# Altium project sion_os.PrjPcb
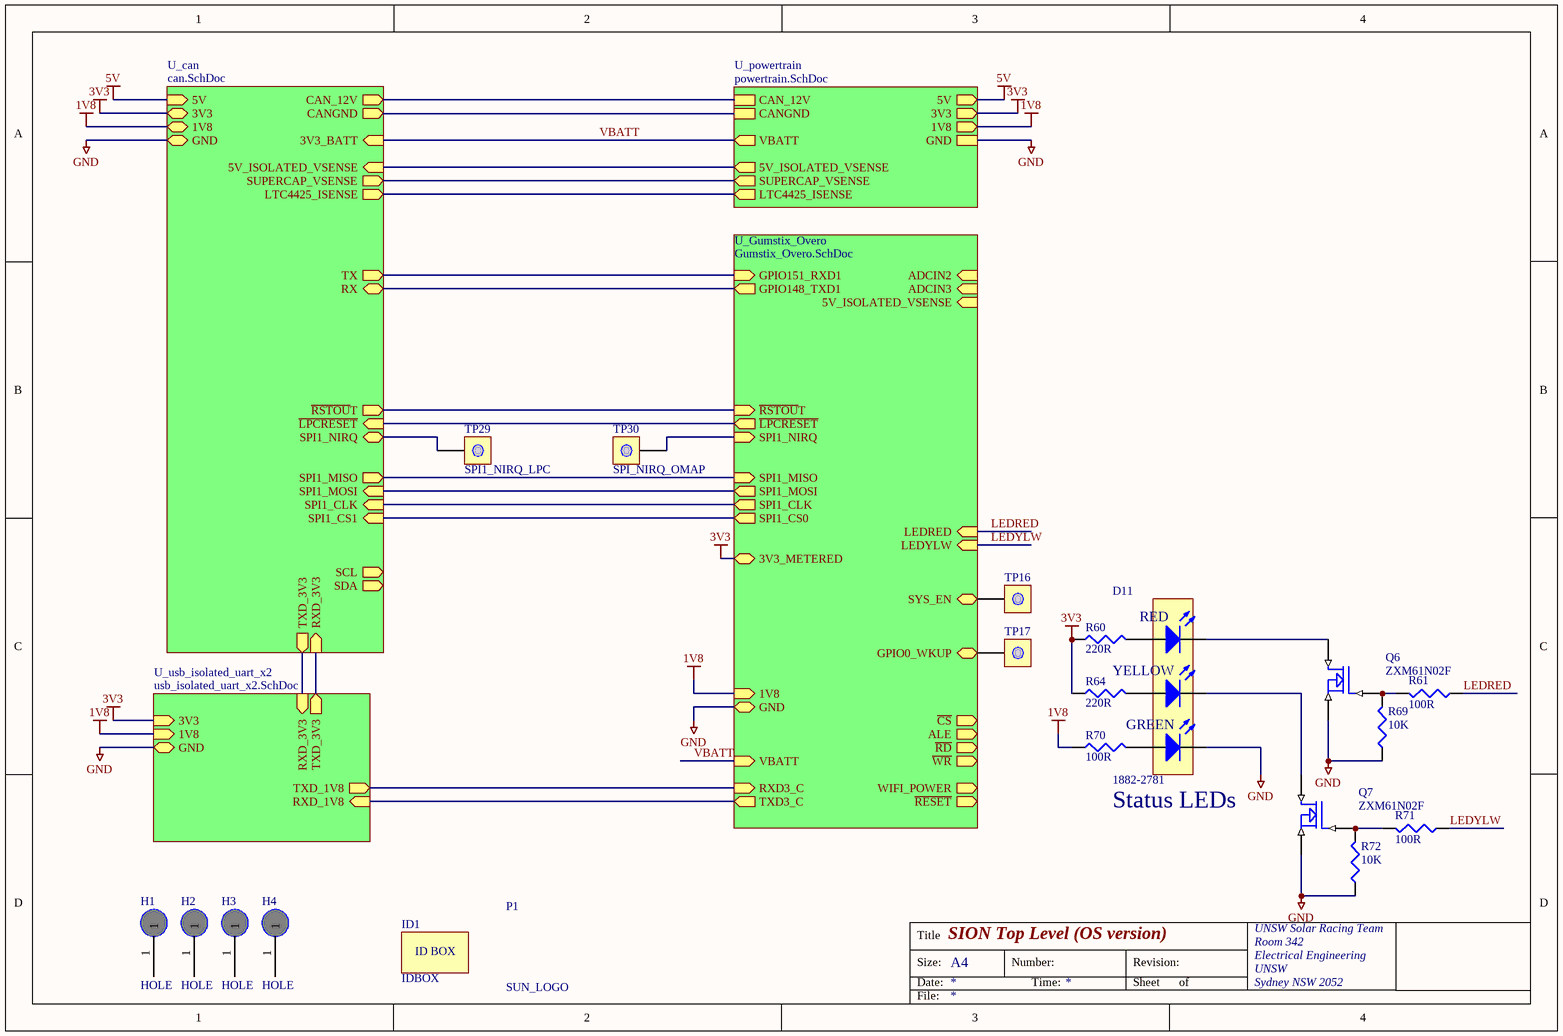
[diagram p0: toplevel_os.SchDoc]
9 sheets, 227 parts. Net scope: hierarchical (ports join the sheet entries above them; power ports are global).
Board files: endpanel_front.PcbDoc, endpanel_back.PcbDoc, sion.PcbDoc
Sheets:
  toplevel_os.SchDoc
    U_powertrain = powertrain.SchDoc
      U_supercap = supercap.SchDoc
      U_sepic = sepic.SchDoc
    U_can = can.SchDoc
      U_LPC1768 = LPC1768.SchDoc
      U_can_transciever_dualvolt_isolated = can_transciever_dualvolt_isolated.SchDoc
    U_usb_isolated_uart_x2 = usb_isolated_uart_x2.SchDoc
    U_Gumstix_Overo = Gumstix_Overo.SchDoc

## Sheet toplevel_os.SchDoc: SION Top Level (OS version)
size A4; Organization: UNSW Solar Racing Team; Address3: UNSW; Address4: Sydney NSW 2052; Address2: Electrical Engineering; Address1: Room 342

### Parts
D11  1882-2781  [LED_TRILEVEL]
H1  HOLE  [#6]
H2  HOLE  [#6]
H3  HOLE  [#6]
H4  HOLE  [#6]
ID1  IDBOX  [IDBOX]
P1  SUN_LOGO  [SUNSWIFTLOGO]
Q6  ZXM61N02F  [SOT23-3]
Q7  ZXM61N02F  [SOT23-3]
R60  220R  [0603]
R61  100R  [0603]
R64  220R  [0603]
R69  10K  [0603]
R70  100R  [0603]
R71  100R  [0603]
R72  10K  [0603]
TP16  SYS_EN  [TESTPOINT]  (value not drawn)
TP17  WKUP  [TESTPOINT]  (value not drawn)
TP29  SPI1_NIRQ_LPC  [TESTPOINT]
TP30  SPI_NIRQ_OMAP  [TESTPOINT]

### Sub-sheets
U_can = can.SchDoc: CAN_12V (out), CANGND (out), 3V3, 1V8, 5V (in), GND, SPI1_MISO (out), SPI1_MOSI (in), SPI1_CLK (in), SPI1_CS1 (in), SPI1_NIRQ, TXD_3V3 (out), RXD_3V3 (in), 3V3_BATT (in), ~{RSTOU}T (out), ~{LPCRESET} (in), SDA (out), SCL (out), TX (out), RX, 5V_ISOLATED_VSENSE (in), LTC4425_ISENSE (out), SUPERCAP_VSENSE (out)
U_Gumstix_Overo = Gumstix_Overo.SchDoc: SPI1_MISO (in), SPI1_MOSI (out), SPI1_CLK (out), SPI1_NIRQ (in), SPI1_CS0 (out), SYS_EN (bidir), RXD3_C (in), TXD3_C (out), ADCIN3 (in), ADCIN2 (in), GPIO148_TXD1 (out), GPIO151_RXD1 (in), GPIO0_WKUP (bidir), ~{CS} (out), ALE (out), ~{RD} (out), ~{WR} (out), 3V3_METERED, 1V8 (in), GND, ~{RSTOU}T (in), ~{LPCRESET} (out), ~{RESET} (out), 5V_ISOLATED_VSENSE (in), WIFI_POWER (out), LEDRED (in), LEDYLW (in), VBATT (in)
U_powertrain = powertrain.SchDoc: GND, 5V_ISOLATED_VSENSE (out), SUPERCAP_VSENSE (out), CAN_12V, CANGND, 3V3 (out), LTC4425_ISENSE (out), 5V (out), 1V8 (out), VBATT (out)
U_usb_isolated_uart_x2 = usb_isolated_uart_x2.SchDoc: TXD_3V3 (out), RXD_3V3 (in), 3V3 (in), 1V8 (in), TXD_1V8 (out), RXD_1V8 (in), GND

### Nets
1V8: R70.1 ; sheet U_powertrain/1V8, sheet U_can/1V8, sheet U_usb_isolated_uart_x2/1V8, sheet U_Gumstix_Overo/1V8
3V3: R60.1 R64.1 ; sheet U_powertrain/3V3, sheet U_can/3V3, sheet U_usb_isolated_uart_x2/3V3, sheet U_Gumstix_Overo/3V3_METERED  [project net VDDA]
5V: sheet U_powertrain/5V, sheet U_can/5V  [project net 5V_REDUNDANT]
CAN_12V: sheet U_powertrain/CAN_12V, sheet U_can/CAN_12V
CANGND: sheet U_powertrain/CANGND, sheet U_can/CANGND
GND: D11.1(K) Q6.2(S) Q7.2(S) R69.1 R72.1 ; sheet U_powertrain/GND, sheet U_can/GND, sheet U_usb_isolated_uart_x2/GND, sheet U_Gumstix_Overo/GND  [project net VREFN]
~{LPCRESET}: sheet U_can/~{LPCRESET}, sheet U_Gumstix_Overo/~{LPCRESET}
LEDRED: R61.1 ; sheet U_Gumstix_Overo/LEDRED
LEDYLW: R71.1 ; sheet U_Gumstix_Overo/LEDYLW
~{PFO}: sheet U_powertrain/5V_ISOLATED_VSENSE, sheet U_can/5V_ISOLATED_VSENSE
~{RSTOU}T: sheet U_can/~{RSTOU}T, sheet U_Gumstix_Overo/~{RSTOU}T
UART1_RXD: sheet U_can/TXD_3V3, sheet U_usb_isolated_uart_x2/RXD_3V3
VBATT: sheet U_powertrain/VBATT, sheet U_can/3V3_BATT, sheet U_Gumstix_Overo/VBATT
NetC35_1: sheet U_powertrain/LTC4425_ISENSE, sheet U_can/LTC4425_ISENSE
NetC36_1: sheet U_powertrain/SUPERCAP_VSENSE, sheet U_can/SUPERCAP_VSENSE
NetD11_2: D11.2(K) Q7.3(D)
NetD11_3: D11.3(K) Q6.3(D)
NetD11_4: D11.4(A) R60.2
NetD11_5: D11.5(A) R64.2
NetD11_6: D11.6(A) R70.2
NetQ6_1: Q6.1(G) R61.2 R69.2
NetQ7_1: Q7.1(G) R71.2 R72.2
NetTP16_0: TP16.0(TP) ; sheet U_Gumstix_Overo/SYS_EN
NetTP17_0: TP17.0(TP) ; sheet U_Gumstix_Overo/GPIO0_WKUP
NetTP19_0: sheet U_can/RXD_3V3, sheet U_usb_isolated_uart_x2/TXD_3V3
NetTP20_0: sheet U_usb_isolated_uart_x2/RXD_1V8, sheet U_Gumstix_Overo/TXD3_C
NetTP22_0: sheet U_usb_isolated_uart_x2/TXD_1V8, sheet U_Gumstix_Overo/RXD3_C
NetTP29_0: TP29.0(TP) ; sheet U_can/SPI1_NIRQ
NetTP30_0: TP30.0(TP) ; sheet U_Gumstix_Overo/SPI1_NIRQ
NetU6_J4_24: sheet U_can/RX, sheet U_Gumstix_Overo/GPIO148_TXD1
NetU6_J4_27: sheet U_can/SPI1_CS1, sheet U_Gumstix_Overo/SPI1_CS0
NetU6_J4_43: sheet U_can/SPI1_CLK, sheet U_Gumstix_Overo/SPI1_CLK
NetU6_J4_44: sheet U_can/SPI1_MOSI, sheet U_Gumstix_Overo/SPI1_MOSI
NetU6_J4_45: sheet U_can/SPI1_MISO, sheet U_Gumstix_Overo/SPI1_MISO
NetU6_J4_48: sheet U_can/TX, sheet U_Gumstix_Overo/GPIO151_RXD1

Not connected (* = marked no-connect by the designer): H1 1; H2 1; H3 1; H4 1

### Notes on the sheet
- Status LEDs
- Title
- Size:
- Date:
- A4
- Number:
- Time:
- Revision:
- Sheet
- of
- File:
- (in symbol IDBOX) ID BOX
- (in symbol LED-TRILEVEL) RED; YELLOW; GREEN

### Library data of the parts
D11 = LED-TRILEVEL: Three level LED; Farnell: 1461596; Digikey: 350-1751-ND; DigikeyPrice: 3.22; FarnellPrice: 4.56
Q6 Q7 = ZXM61N02F: 1.7A, 20V N-Channel Enhancement mode FET; Digikey: ZXM61N02FCT-ND; DigikeyPrice: 0.66; Farnell: 9525270; FarnellPrice: 1.35
R60 R61 R64 R69-R72 = RES1: Resistor; Order#: 9331697; Supplier: Farnell; Price: 0.05
TP16 TP17 TP29 TP30 = TEST: TEST POINT

## Sheet powertrain.SchDoc: SION Power Train
size A4; Organization: UNSW Solar Racing Team; Address3: UNSW; Address4: Sydney NSW 2052; Address2: Electrical Engineering; Address1: Rm 342
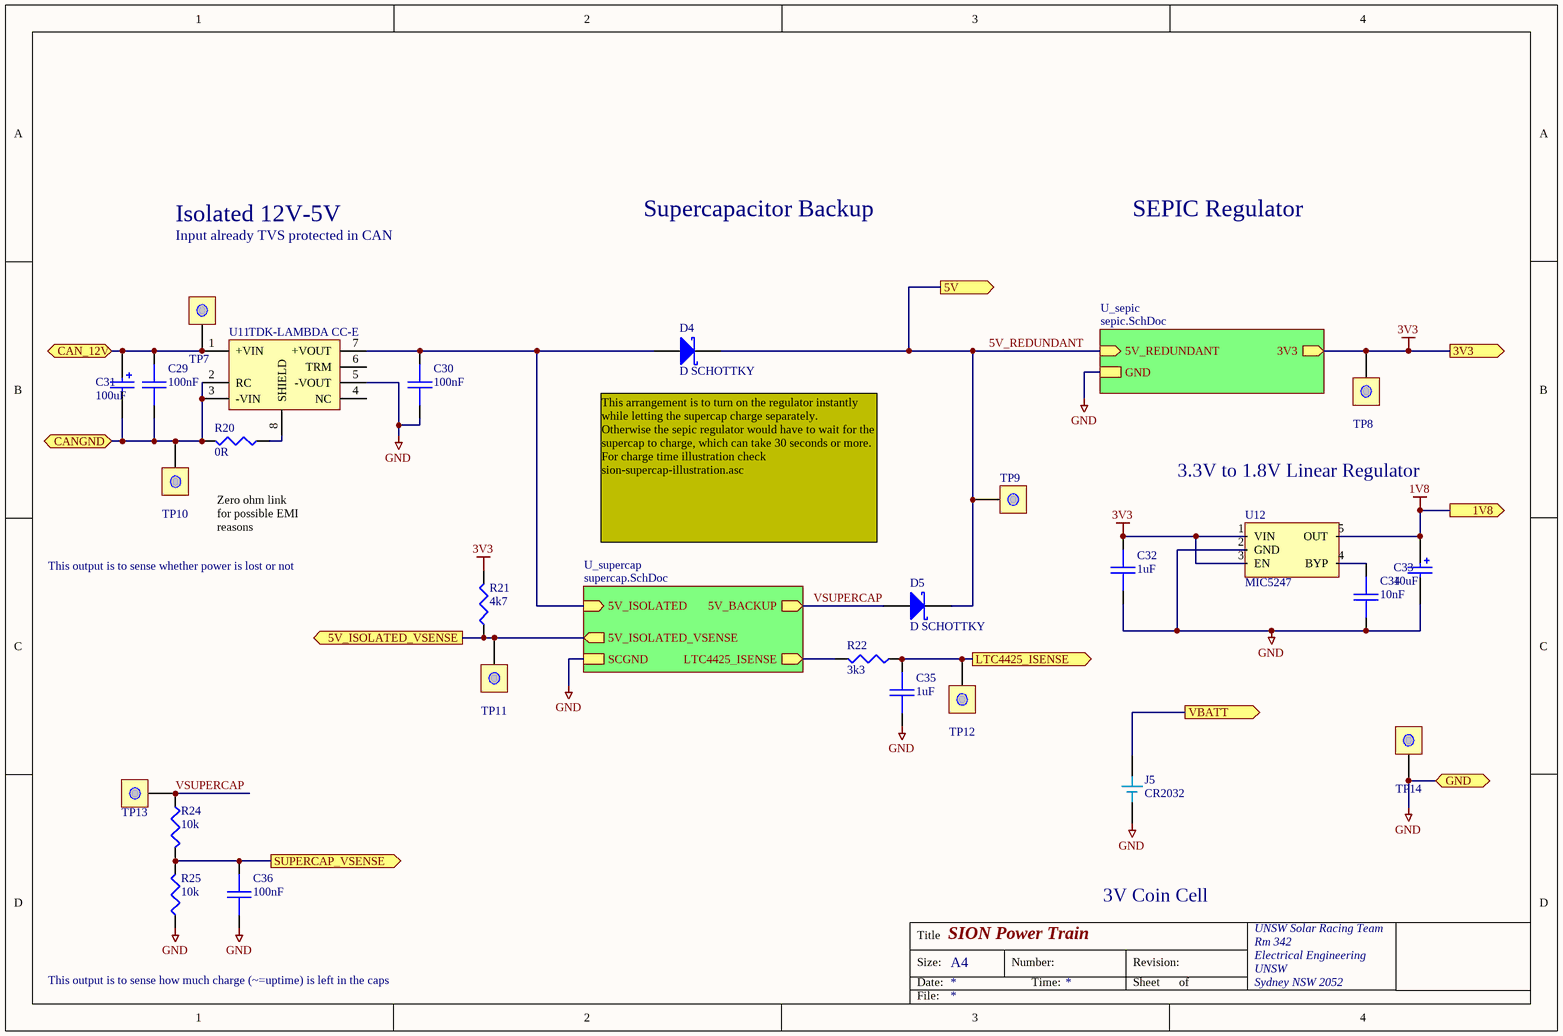
[diagram p1: powertrain.SchDoc]

### Parts
C29  100nF  [0603]
C30  100nF  [0603]
C31  100uF  [MCCT-CASED]
C32  1uF  [0805]
C33  10uF  [MCCT-CASEA]
C34  10nF  [0603]
C35  1uF  [0805]
C36  100nF  [0603]
D4  D SCHOTTKY  [DIODE-D1.5mm]
D5  D SCHOTTKY  [DIODE-D1.5mm]
J5  CR2032  [CR2032_VERTICAL]
R20  0R  [1206]
R21  4k7  [0603]
R22  3k3  [0603]
R24  10k  [0805]
R25  10k  [0805]
TP7  CAN12V  [TESTPOINT]  (value not drawn)
TP8  3V3  [TESTPOINT]  (value not drawn)
TP9  5V  [TESTPOINT]  (value not drawn)
TP10  CANGND  [TESTPOINT]  (value not drawn)
TP11  VSENSE  [TESTPOINT]  (value not drawn)
TP12  ISENSE  [TESTPOINT]  (value not drawn)
TP13  VCAP  [TESTPOINT]  (value not drawn)
TP14  GND  [TESTPOINT]  (value not drawn)
U11  TDK-LAMBDA CC-E  [CC10-F-E]
U12  MIC5247  [SOT23-5]

### Sub-sheets
U_sepic = sepic.SchDoc: 3V3 (out), 5V_REDUNDANT (in), GND
U_supercap = supercap.SchDoc: LTC4425_ISENSE (out), 5V_ISOLATED (in), 5V_BACKUP (out), SCGND, 5V_ISOLATED_VSENSE (out)

### Ports
1V8 (out), 3V3 (out), 5V (out), 5V_ISOLATED_VSENSE (out), CAN_12V, CANGND, GND, LTC4425_ISENSE (out), SUPERCAP_VSENSE (out), VBATT (out)

### Nets
1V8: C33.1 U12.5(OUT) ; port 1V8
3V3: C32.1 R21.2 TP8.0(TP) U12.1(VIN) U12.3(EN) ; port 3V3, sheet U_sepic/3V3  [project net VDDA]
5V_REDUNDANT: D4.K D5.K TP9.0(TP) ; port 5V, sheet U_sepic/5V_REDUNDANT
CAN_12V: C29.1 C31.1 TP7.0(TP) U11.1(+VIN) ; port CAN_12V
CANGND: C29.2 C31.2 R20.2 TP10.0(TP) U11.2(RC) U11.3(-VIN) ; port CANGND
GND: C30.2 C32.2 C33.2 C34.2 C35.2 C36.2 J5.2 R25.1 TP14.0(TP) U11.5(-VOUT) U12.2(GND) ; port GND, sheet U_supercap/SCGND, sheet U_sepic/GND  [project net VREFN]
5V_ISOLATED: C30.1 D4.A U11.7(+VOUT) ; sheet U_supercap/5V_ISOLATED
~{PFO}: R21.1 TP11.0(TP) ; port 5V_ISOLATED_VSENSE, sheet U_supercap/5V_ISOLATED_VSENSE
PROG: R22.2 ; sheet U_supercap/LTC4425_ISENSE
VBATT: J5.1(3V) ; port VBATT
VSUPERCAP: D5.A R24.1 TP13.0(TP) ; sheet U_supercap/5V_BACKUP
NetC34_1: C34.1 U12.4(BYP)
NetC35_1: C35.1 R22.1 TP12.0(TP) ; port LTC4425_ISENSE
NetC36_1: C36.1 R24.2 R25.2 ; port SUPERCAP_VSENSE
NetR20_1: R20.1 U11.8(SHIELD)

Not connected (* = marked no-connect by the designer): U11 4(NC) 6(TRM)

### Notes on the sheet
- Isolated 12V-5V
- Input already TVS protected in CAN
- Supercapacitor Backup
- SEPIC Regulator
- 3.3V to 1.8V Linear Regulator
- This output is to sense whether power is lost or not
- Zero ohm link
  for possible EMI reasons
- (near D4) This arrangement is to turn on the regulator instantly while letting the supercap charge separately.
  Otherwise the sepic regulator would have to wait for the supercap to charge, which can take 30 seconds or more.
  For charge time illustration check sion-supercap-illustration.asc
- 3V Coin Cell
- This output is to sense how much charge (~=uptime) is left in the caps
- Title
- Size:
- Date:
- A4
- Number:
- Time:
- Revision:
- Sheet
- of
- File:

### Library data of the parts
C29 C30 C32 C34-C36 = CAP: Capacitor
C31 C33 = CAP POL3: Polarized Capacitor (Surface Mount); Revision: July-2002: Re-released for DXP Platform.
  C31: Digikey: 495-2256-1-ND; DigikeyPrice: 1.24; Farnell: 1658601; FarnellPrice: 2.64
  C33: Digikey: 399-3687-1-ND; DigikeyPrice: 0.54; Farnell: 1650980; FarnellPrice: 0.786
D4 D5 = D SCHOTTKY: Schottky Diode; RS: 3954196; Revision: July-2002: Re-released for DXP Platform.; Digikey: 95SQ015-ND; DigikeyPrice: 3.36; Farnell: 506795; FarnellPrice: 8.61
J5 = CR2032: Battery Coin CR2032 3V; Farnell: 1216359; Farnellprice: 3.97
R20-R22 R24 R25 = RES1: Resistor
  R24 R25: Farnell: 1612522; FarnellPrice: 0.022; Digikey: P10.0KCCT-ND; DigikeyPrice: 0.07
TP7-TP14 = TEST: TEST POINT
U11 = CC10-F-E: Isolated DC-DC Converter; Digikey: 445-2435-ND; Farnell: 1547717; FarnellPrice: 56.78; DigikeyPrice: 26.66
U12 = MIC5247: 150mA Low-Voltage Linear Regulator; Digikey: 576-1288-1-ND; DigikeyPrice: 1.08

## Sheet supercap.SchDoc: SION Supercapacitor Charger
size A4; Organization: UNSW Solar Racing Team; Address3: UNSW; Address4: Sydney NSW 2052; Address2: Electrical Engineering; Address1: Room 342
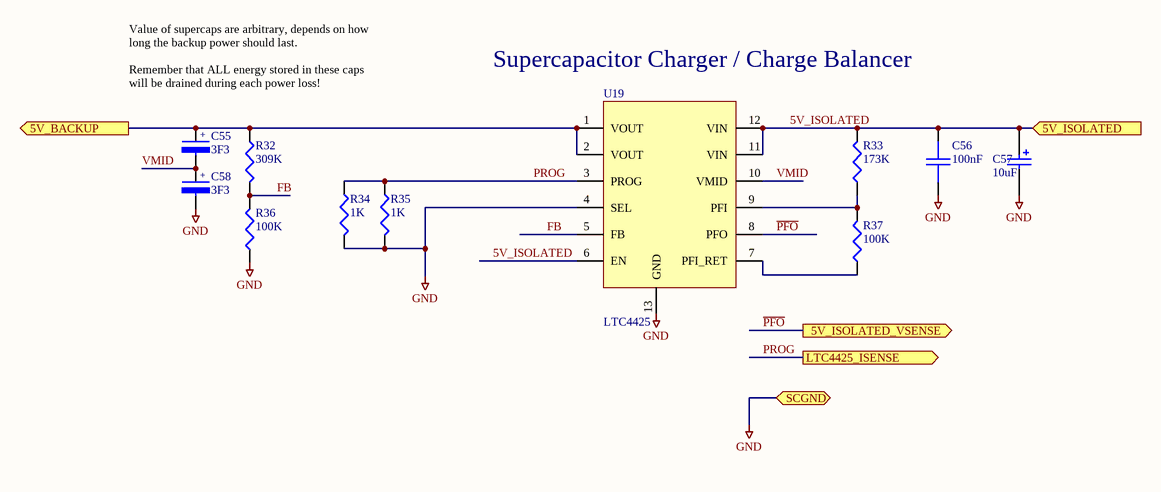
[diagram p2: supercap.SchDoc]

### Parts
C55  3F3  [ELECTROLYTIC-5-32]
C56  100nF  [0603]
C57  10uF  [MCCT-CASEA]
C58  3F3  [ELECTROLYTIC-5-32]
R32  309K  [0603]
R33  173K  [0805]
R34  1K  [0603]
R35  1K  [0603]
R36  100K  [0603]
R37  100K  [0603]
U19  LTC4425  [MS-12]

### Ports
5V_BACKUP (out), 5V_ISOLATED (in), 5V_ISOLATED_VSENSE (out), LTC4425_ISENSE (out), SCGND

### Nets
GND: C56.2 C57.2 C58.2 R34.2 R35.2 R36.1 U19.4(SEL) U19.13(GND) ; port SCGND  [project net VREFN]
5V_ISOLATED: C56.1 C57.1 R33.2 U19.6(EN) U19.11(VIN) U19.12(VIN) ; port 5V_ISOLATED
FB: R32.2 R36.2 U19.5(FB)
~{PFO}: U19.8(PFO) ; port 5V_ISOLATED_VSENSE
PROG: R34.1 R35.1 U19.3(PROG) ; port LTC4425_ISENSE
VMID: C55.2 C58.1 U19.10(VMID)
VSUPERCAP: C55.1 R32.1 U19.1(VOUT) U19.2(VOUT) ; port 5V_BACKUP
NetR33_1: R33.1 R37.2 U19.9(PFI)
NetR37_1: R37.1 U19.7(PFI_RET)

### Notes on the sheet
- Supercapacitor Charger / Charge Balancer
- Value of supercaps are arbitrary, depends on how long the backup power should last.
  Remember that ALL energy stored in these caps will be drained during each power loss!
- Title
- Size:
- Date:
- A4
- Number:
- Time:
- Revision:
- Sheet
- of
- File:
- (in symbol CAP-POL) +

### Library data of the parts
C55 C58 = CAP-POL: Supercap; Notes: Nichicon is preferred - higher voltage.; Digikey: 493-3293-ND; Farnell: 1853360; DigikeyPrice: 3.05; FarnellPrice: 4.15
C56 = CAP: Capacitor
C57 = CAP POL3: Polarized Capacitor (Surface Mount); Revision: July-2002: Re-released for DXP Platform.; Digikey: 399-3687-1-ND; DigikeyPrice: 0.54; Farnell: 1650980; FarnellPrice: 0.786
R32-R37 = RES1: Resistor
  R32: Farnell: 1797157; Digikey: P309KHCT-ND; DigikeyPrice: 0.04; FarnellPrice: 0.559
  R33: FArnell: 1151739; FarnellPrice: 0.157; Digikey: P75.0KHCT-ND; DigikeyPrice: 0.04
  R34 R35: Farnell: 9364366; Digikey: RR08P1.0KDCT-ND; DigikeyPrice: 0.148; FarnellPrice: 0.04
  R36 R37: Farnell: 1344361; FarnellPrice: 0.02; Digikey: CRT0603-BY-1003ELFCT-ND; DigikeyPrice: 0.25
U19 = LTC4425: Supercapacitor Charger; Farnell: 1839114; FarnellPrice: 12.63; Digikey: LTC4425EMSE#PBF-ND; DigikeyPrice: 5.0

## Sheet sepic.SchDoc: SION SEPIC v2 Prototype
size A4; Organization: UNSW Solar Racing Team; Address3: UNSW; Address4: Sydney NSW 2052; Address2: Electrical Engineering; Address1: Room 342
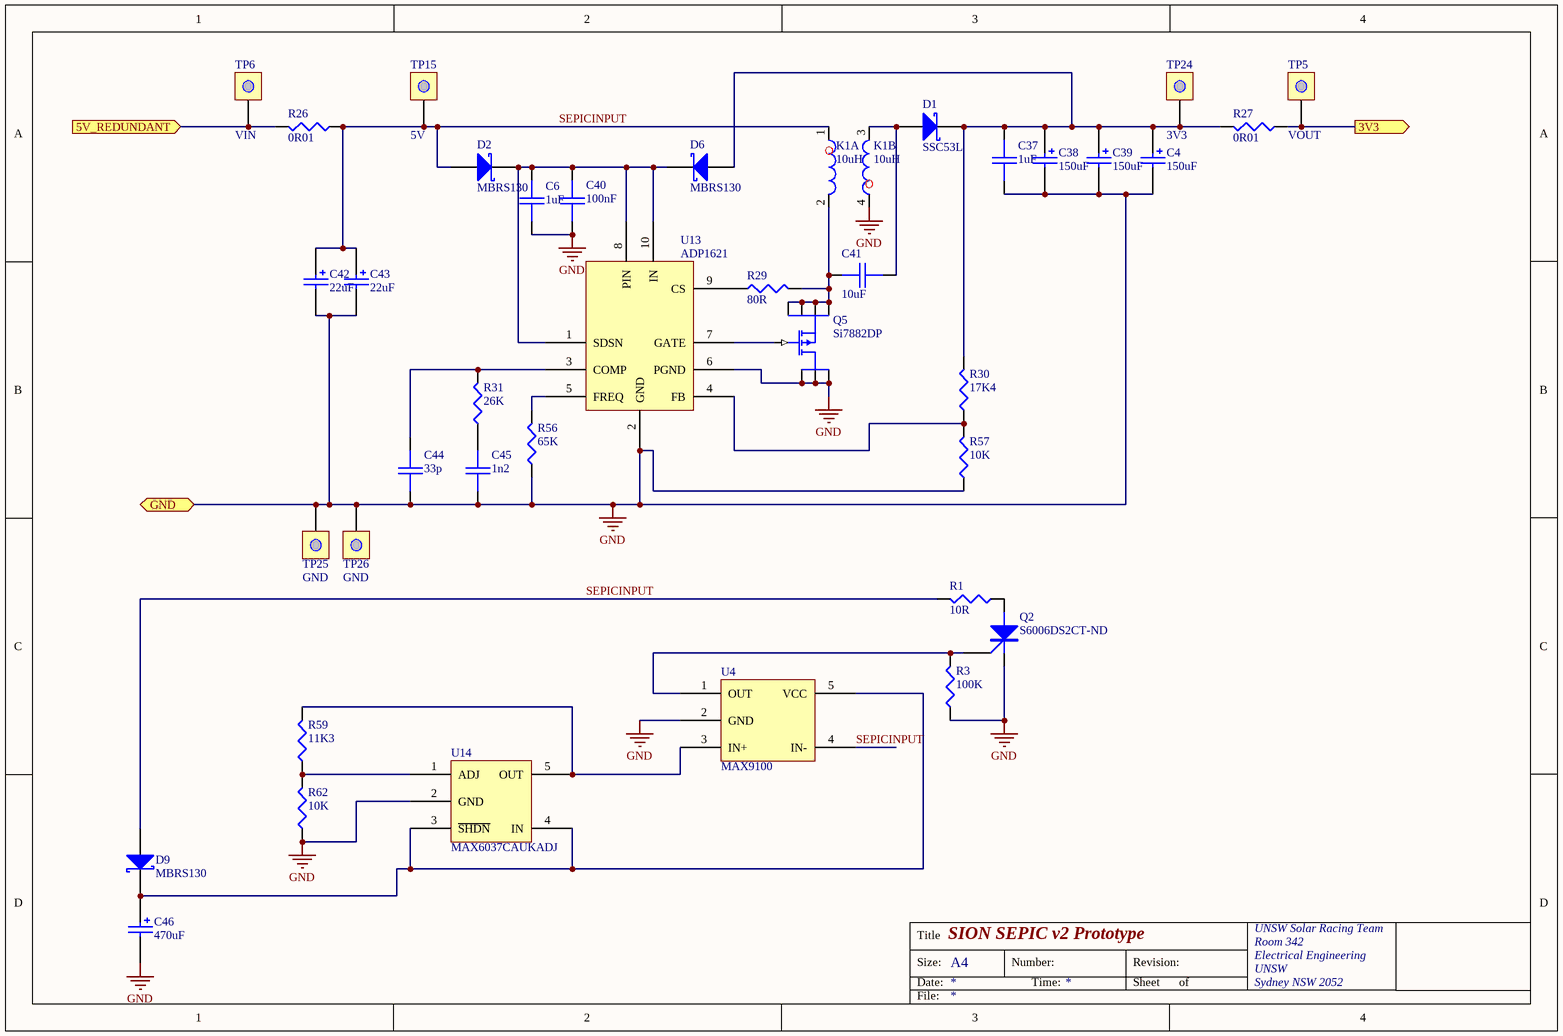
[diagram p3: sepic.SchDoc]

### Parts
C4  150uF  [MCCT-CASED]
C6  1uF  [0805]
C37  1uF  [0805]
C38  150uF  [MCCT-CASED]
C39  150uF  [MCCT-CASED]
C40  100nF  [0603]
C41  10uF  [0805]
C42  22uF  [MCCT-CASEB]
C43  22uF  [MCCT-CASEB]
C44  33p  [0603]
C45  1n2  [0603]
C46  470uF  [MCCT-CASED]
D1  SSC53L  [SMC]
D2  MBRS130  [SMB]
D6  MBRS130  [SMB]
D9  MBRS130  [SMB]
K1  10uH  [CTX2]  (parts A,B of 2)
Q2  S6006DS2CT-ND  [DPAK_N-MOSFET]
Q5  Si7882DP  [SO8]
R1  10R  [DIODE0.7]
R3  100K  [1206]
R26  0R01  [1206]
R27  0R01  [1206]
R29  80R  [0603]
R30  17K4  [1206]
R31  26K  [1206]
R56  65K  [0603]
R57  10K  [1206]
R59  11K3  [1206]
R62  10K  [1206]
TP5  VOUT  [TESTPOINT]
TP6  VIN  [TESTPOINT]
TP15  5V  [TESTPOINT]
TP24  3V3  [TESTPOINT]
TP25  GND  [TESTPOINT]
TP26  GND  [TESTPOINT]
U4  MAX9100  [SOT23-5]
U13  ADP1621  [MSOP10]
U14  MAX6037CAUKADJ  [SOT23-5]

### Ports
3V3 (out), 5V_REDUNDANT (in), GND

### Nets
5V_REDUNDANT: R26.2 TP6.0(TP) ; port 5V_REDUNDANT
GND: C4.2 C6.2 C37.2 C38.2 C39.2 C40.1 C42.2 C43.2 C44.2 C45.2 C46.2 K1.4 Q2.1(K) Q5.1(S) Q5.2(S) Q5.3(S) R3.1 R56.1 R57.1 R62.1 TP25.0(TP) TP26.0(TP) U4.2(GND) U13.2(GND) U13.6(PGND) U14.2(GND) ; port GND  [project net VREFN]
VDDA: R27.1 TP5.0(TP) ; port 3V3
SEPICINPUT: C42.1 C43.1 D2.A D9.A K1.1 R1.2 R26.1 TP15.0(TP) U4.4(IN-)
NetC4_1: C4.1 C37.1 C38.1 C39.1 D1.K D6.A R27.2 R30.2 TP24.0(TP)
NetC6_1: C6.1 C40.2 D2.K D6.K U13.1(SDSN) U13.8(PIN) U13.10(IN)
NetC41_1: C41.1 K1.2 Q5.5(D) Q5.6(D) Q5.7(D) Q5.8(D) R29.2
NetC41_2: C41.2 D1.A K1.3
NetC44_1: C44.1 R31.2 U13.3(COMP)
NetC45_1: C45.1 R31.1
NetC46_1: C46.1 D9.K U4.5(VCC) U14.3(~{SHDN}) U14.4(IN)
NetQ2_2: Q2.2(A) R1.1
NetQ2_3: Q2.3(G) R3.2 U4.1(OUT)
NetQ5_4: Q5.4(G) U13.7(GATE)
NetR29_1: R29.1 U13.9(CS)
NetR30_1: R30.1 R57.2 U13.4(FB)
NetR56_2: R56.2 U13.5(FREQ)
NetR59_1: R59.1 R62.2 U14.1(ADJ)
NetR59_2: R59.2 U4.3(IN+) U14.5(OUT)

### Notes on the sheet
- Title
- Size:
- Date:
- A4
- Number:
- Time:
- Revision:
- Sheet
- of
- File:

### Library data of the parts
C4 C38 C39 C42 C43 C46 = CAP POL3: Polarized Capacitor (Surface Mount); Manufacturer: Generic Components; Class I: Passive; Value: 100pF; Published: 8-Jun-2000; Revision: July-2002: Re-released for DXP Platform.; Publisher: Altium Limited; Class II: Capacitor
  C4 C38 C39: Farnell: 1754096; FarnellPrice: 2.97
  C42 C43: Farnell: 1457447; FarnellPrice: 1.06
  C46: Digikey: 718-1780-1-ND
C6 C37 C40 C44 C45 = CAP: Capacitor
  C6 C37: Farnell: 1683651; FarnellPrice: 0.05
  C44: Farnell: 1816801; FarnellPrice: 0.05
  C45: Farnell: 3019664; FarnellPrice: 0.167
C41 = CAP: grm21br61a106k; Farnell: 1828805; FarnellPrice: 0.448
D1 D2 D6 D9 = D SCHOTTKY: Schottky Diode; Manufacturer: Generic Components; Class I: Discrete; Class II: Diode - Schottky; Published: 8-Jun-2000; Revision: July-2002: Re-released for DXP Platform.; Publisher: Altium Limited
  D1: Farnell: 1336558; FarnellPrice: 2.64
  D2 D6 D9: Farnell: 9556931; FarnellPrice: 0.43
K1 = CTX10-2-R: Coupled Power Inductor; Farnell: 1194198; Price: 8.53
Q2 = SCR: Sensitive SCR; Digikey: S6006DS2CT-ND
Q5 = Si7882DP: Power N mosfet; Farnell: 1470159; FarnellPrice: 5.15
R1 R3 R26 R27 R29-R31 R56 R57 R59 R62 = RES1: Resistor
  R1: Farnell: 1357872; FarnellPrice: 0.119
  R3 R57: Farnell: 1469669; FarnellPrice: 0.02
  R26 R27: Farnell: 8067520; FarnellPrice: 0.616
  R29: Farnell: 1644187; FarnellPrice: 0.075
  R30: Farnell: 1152720; FarnellPrice: 0.02
  R31: Farnell: 1152861; FarnellPrice: 0.02
  R56: Farnell: 1633712; FarnellPrice: 0.01
  R59: Digikey: RNCF1206BKC11K3CT-ND
  R62: Digikey: CRT1206-BY-1002ELFCT-ND
TP5 TP6 TP15 TP24-TP26 = TEST: TEST POINT
U4 = MAX9100EUK: Micropower comparator; Digikey: MAX9100EUK+TCT-ND
U13 = ADP1621: SEPIC / Boost Controller; Digikey: ADP1621ARMZ-R7CT-ND; DigikeyPrice: 2.97; Farnell: 1461500; FarnellPrice: 5.27
U14 = MAX6037CAUKADJ: Adjustable voltage reference; Digikey: MAX6037CAUKADJ+TCT-ND; DigikeyPrice: 2.05

## Sheet can.SchDoc
size A4; Organization: UNSW Solar Racing Team; Address3: UNSW; Address4: Sydney NSW 2052; Address2: Electrical Engineering; Address1: Room 342
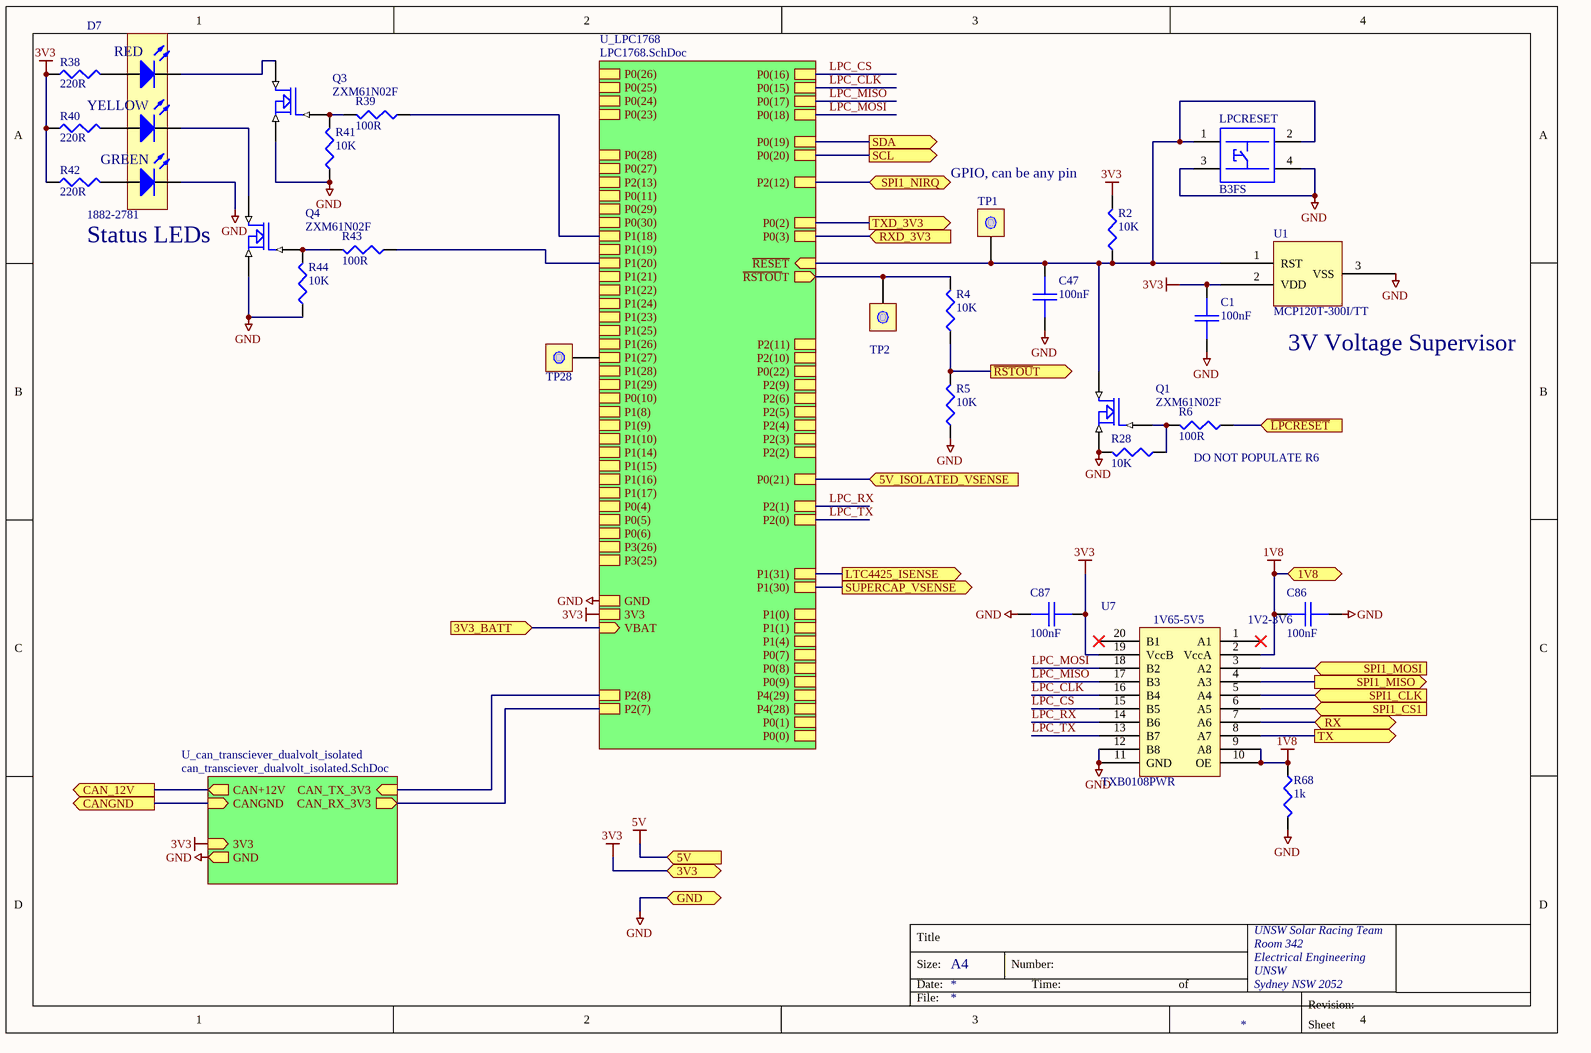
[diagram p4: can.SchDoc]

### Parts
C1  100nF  [0603]
C47  100nF  [0603]
C86  100nF  [0603]
C87  100nF  [0603]
D7  1882-2781  [LED_TRILEVEL]
LPCRESET  B3FS  [B3FS-1052]
Q1  ZXM61N02F  [SOT23-3]
Q3  ZXM61N02F  [SOT23-3]
Q4  ZXM61N02F  [SOT23-3]
R2  10K  [0603]
R4  10K  [0603]
R5  10K  [0603]
R6  100R  [0603]
R28  10K  [0603]
R38  220R  [0603]
R39  100R  [0603]
R40  220R  [0603]
R41  10K  [0603]
R42  220R  [0603]
R43  100R  [0603]
R44  10K  [0603]
R68  1k  [0603]
TP1  RESET  [TESTPOINT]  (value not drawn)
TP2  RSTOUT  [TESTPOINT]  (value not drawn)
TP28  CLKOUT  [TESTPOINT]  (value not drawn)
U1  MCP120T-300I/TT  [SOT23-3]
U7  TXB0108PWR  [TSSOP20]

### Sub-sheets
U_can_transciever_dualvolt_isolated = can_transciever_dualvolt_isolated.SchDoc: CAN+12V (out), CANGND, GND (out), 3V3, CAN_RX_3V3 (out), CAN_TX_3V3 (in)
U_LPC1768 = LPC1768.SchDoc: P0(26), P0(25), P0(24), P0(23), P1(31), P1(30), P0(28), P0(27), P3(26), P3(25), P0(29), P0(30), P1(18), P1(19), P1(20), P1(21), P1(22), P1(24), P1(23), P1(25), P1(26), P1(27), P1(28), P1(29), P0(0), P0(1), P0(10), P0(11), P2(13), P2(12), P2(11), P2(10), P0(22), P0(21), P0(20), P0(19), P0(18), P0(17), P0(15), P0(16), P2(9), P2(8), P2(7), P2(6), P2(5), P2(4), P2(3), P2(2), P2(1), P2(0), P0(2), P0(3), P1(0), P1(1), P1(4), P1(8), P1(9), P1(10), P1(14), P1(15), P1(16), P1(17), P0(4), P0(5), P0(6), P0(7), P0(8), P0(9), P4(29), P4(28), GND, 3V3, ~{RSTOU}T (out), ~{RESET} (in), VBAT (in)

### Ports
1V8, 3V3, 3V3_BATT (in), 5V (in), 5V_ISOLATED_VSENSE (in), CAN_12V (out), CANGND (out), GND, LTC4425_ISENSE (out), RX, RXD_3V3 (in), SCL (out), SDA (out), SPI1_CLK (in), SPI1_CS1 (in), SPI1_MISO (out), SPI1_MOSI (in), SPI1_NIRQ, SUPERCAP_VSENSE (out), TX (out), TXD_3V3 (out), ~{LPCRESET} (in), ~{RSTOU}T (out)

### Nets
1V8: C86.2 R68.2 U7.2(VccA) U7.9(A8) U7.10(OE) ; port 1V8
3V3: C1.1 C87.1 R2.2 R38.1 R40.1 R42.1 U1.2(VDD) U7.19(VccB) ; port 3V3, sheet U_LPC1768/3V3, sheet U_can_transciever_dualvolt_isolated/3V3  [project net VDDA]
CAN_12V: port CAN_12V, sheet U_can_transciever_dualvolt_isolated/CAN+12V
CANGND: port CANGND, sheet U_can_transciever_dualvolt_isolated/CANGND
GND: C1.2 C47.2 C86.1 C87.2 D7.1(K) LPCRESET.3(B2) LPCRESET.4(B1) Q1.2(S) Q3.2(S) Q4.2(S) R5.1 R28.2 R41.1 R44.1 R68.1 U1.3(VSS) U7.11(GND) U7.12(B8) ; port GND, sheet U_LPC1768/GND, sheet U_can_transciever_dualvolt_isolated/GND  [project net VREFN]
~{LPCRESET}: R6.2 ; port ~{LPCRESET}
LPC_CLK: U7.16(B4) ; sheet U_LPC1768/P0(15)
LPC_CS: U7.15(B5) ; sheet U_LPC1768/P0(16)
LPC_MISO: U7.17(B3) ; sheet U_LPC1768/P0(17)
LPC_MOSI: U7.18(B2) ; sheet U_LPC1768/P0(18)
LPC_RX: U7.14(B6) ; sheet U_LPC1768/P2(1)
LPC_TX: U7.13(B7) ; sheet U_LPC1768/P2(0)
~{PFO}: port 5V_ISOLATED_VSENSE, sheet U_LPC1768/P0(21)
~{RSTOU}T: R4.1 R5.2 ; port ~{RSTOU}T
SRST: C47.1 LPCRESET.1(A1) LPCRESET.2(A2) Q1.3(D) R2.1 TP1.0(TP) U1.1(RST) ; sheet U_LPC1768/~{RESET}
UART1_RXD: port TXD_3V3, sheet U_LPC1768/P0(2)
VBATT: port 3V3_BATT, sheet U_LPC1768/VBAT
NetC35_1: port LTC4425_ISENSE, sheet U_LPC1768/P1(31)
NetC36_1: port SUPERCAP_VSENSE, sheet U_LPC1768/P1(30)
NetD7_2: D7.2(K) Q4.3(D)
NetD7_3: D7.3(K) Q3.3(D)
NetD7_4: D7.4(A) R38.2
NetD7_5: D7.5(A) R40.2
NetD7_6: D7.6(A) R42.2
NetQ1_1: Q1.1(G) R6.1 R28.1
NetQ3_1: Q3.1(G) R39.2 R41.2
NetQ4_1: Q4.1(G) R43.2 R44.2
NetR4_2: R4.2 TP2.0(TP) ; sheet U_LPC1768/~{RSTOU}T
NetR39_1: R39.1 ; sheet U_LPC1768/P1(18)
NetR43_1: R43.1 ; sheet U_LPC1768/P1(20)
NetTP3_0: sheet U_LPC1768/P2(7), sheet U_can_transciever_dualvolt_isolated/CAN_RX_3V3
NetTP4_0: sheet U_LPC1768/P2(8), sheet U_can_transciever_dualvolt_isolated/CAN_TX_3V3
NetTP19_0: port RXD_3V3, sheet U_LPC1768/P0(3)
NetTP28_0: TP28.0(TP) ; sheet U_LPC1768/P1(27)
NetTP29_0: port SPI1_NIRQ, sheet U_LPC1768/P2(12)
NetU6_J4_24: U7.7(A6) ; port RX
NetU6_J4_27: U7.6(A5) ; port SPI1_CS1
NetU6_J4_43: U7.5(A4) ; port SPI1_CLK
NetU6_J4_44: U7.3(A2) ; port SPI1_MOSI
NetU6_J4_45: U7.4(A3) ; port SPI1_MISO
NetU6_J4_48: U7.8(A7) ; port TX
NetU10_58: port SCL, sheet U_LPC1768/P0(20)
NetU10_59: port SDA, sheet U_LPC1768/P0(19)

Not connected (* = marked no-connect by the designer): U7 1(A1)* 20(B1)*

### Notes on the sheet
- GPIO, can be any pin
- Status LEDs
- (near U1) 3V Voltage Supervisor
- DO NOT POPULATE R6
- Title
- Size:
- Date:
- A4
- Number:
- Time:
- of
- File:
- Revision:
- Sheet
- (in symbol LED-TRILEVEL) RED; YELLOW; GREEN
- (in symbol TXB0108PWR) 1V65-5V5; 1V2-3V6

### Library data of the parts
C1 C47 C86 C87 = CAP: Capacitor
D7 = LED-TRILEVEL: Three level LED; Farnell: 1461596; Digikey: 350-1751-ND; DigikeyPrice: 3.22; FarnellPrice: 4.56
LPCRESET = B3FS: SMD tactile switch; Farnell: 3121197; OMRON: B3FS-1052; Digikey: SW792-ND
Q1 Q3 Q4 = ZXM61N02F: 1.7A, 20V N-Channel Enhancement mode FET; Digikey: ZXM61N02FCT-ND; DigikeyPrice: 0.66; Farnell: 9525270; FarnellPrice: 1.35
R2 R4 R5 R28 R38-R44 = RES1: Resistor; Order#: 9331697; Supplier: Farnell; Price: 0.05
R6 R68 = RES1: Resistor
TP1 TP2 TP28 = TEST: TEST POINT
U1 = MCP120T: Voltage Supervisor; Farnell: 1292233; FarnellPrice: 0.951; Digikey: MCP120T-300I/TTCT-ND; DigikeyPrice: 0.54
U7 = TXB0108PWR: 4 bit bidirectional auto direction sense level translator; Digikey: 296-21527-1-ND

## Sheet LPC1768.SchDoc: LPC1768
size A4; Organization: UNSW Solar Racing Team; Address3: UNSW; Address4: Sydney NSW 2052; Address2: Electrical Engineering; Address1: Room 342
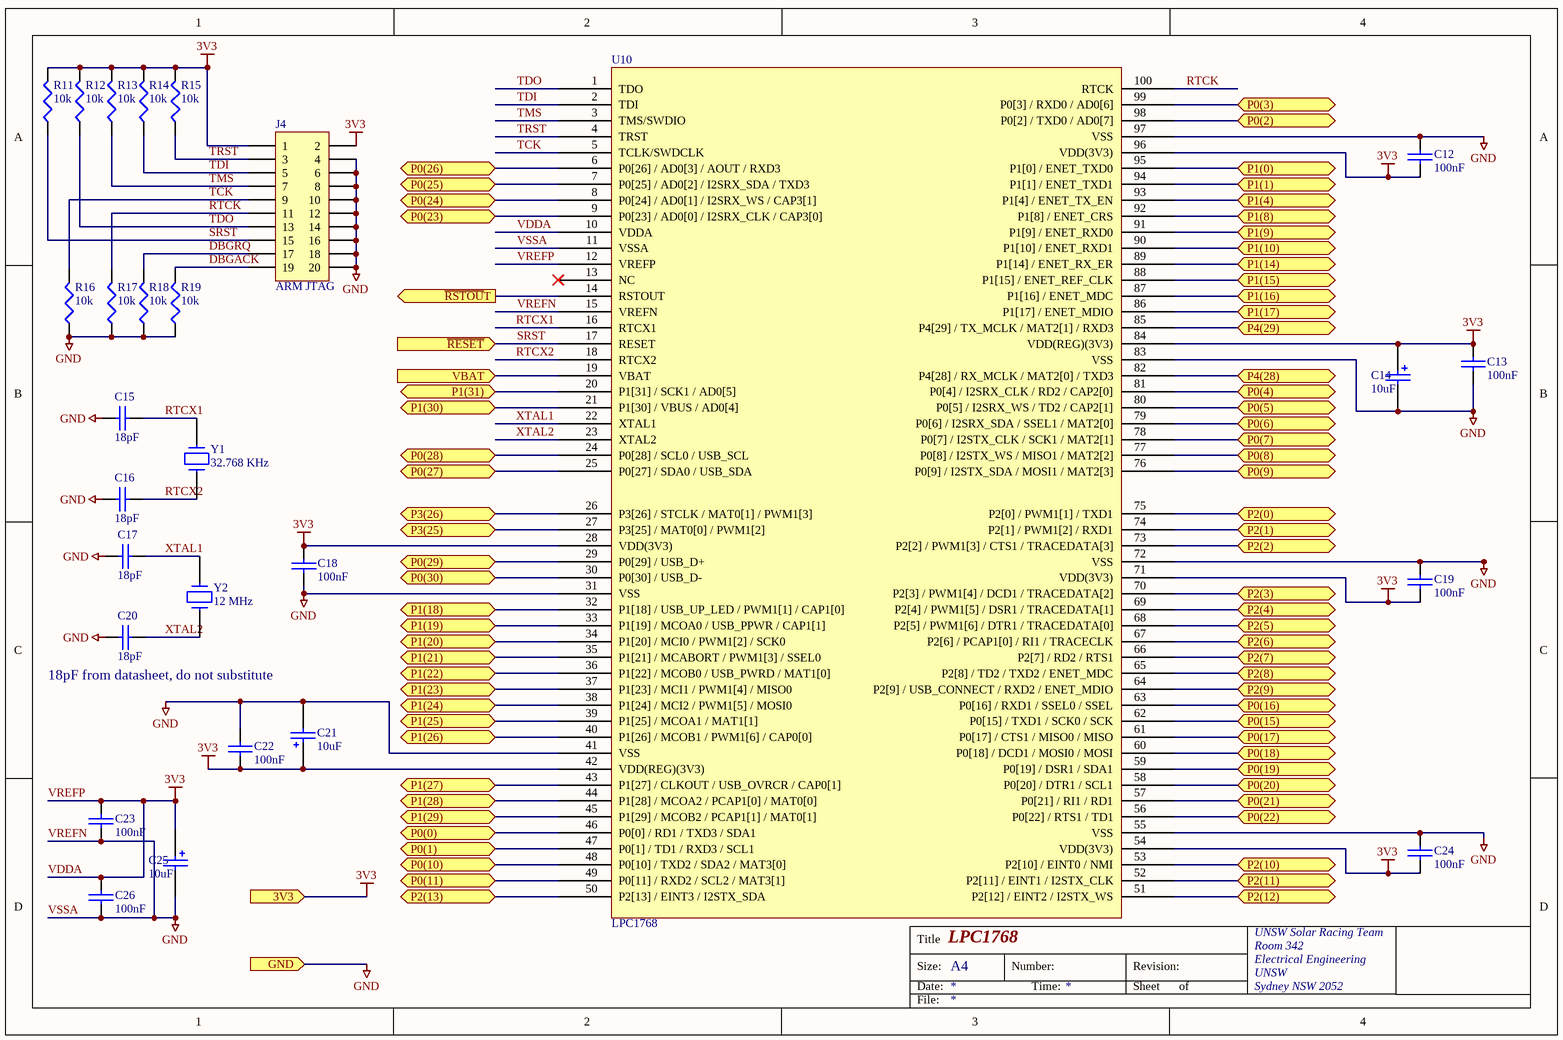
[diagram p5: LPC1768.SchDoc]

### Parts
C12  100nF  [0603]
C13  100nF  [0603]
C14  10uF  [MCCT-CASEA]
C15  18pF  [0603]
C16  18pF  [0603]
C17  18pF  [0603]
C18  100nF  [0603]
C19  100nF  [0603]
C20  18pF  [0603]
C21  10uF  [MCCT-CASEA]
C22  100nF  [0603]
C23  100nF  [0603]
C24  100nF  [0603]
C25  10uF  [MCCT-CASEA]
C26  100nF  [0603]
J4  ARM JTAG  [HDR2X10]
R11  10k  [0603]
R12  10k  [0603]
R13  10k  [0603]
R14  10k  [0603]
R15  10k  [0603]
R16  10k  [0603]
R17  10k  [0603]
R18  10k  [0603]
R19  10k  [0603]
U10  LPC1768  [QFP100]
Y1  32.768 KHz  [WATCHA]
Y2  12 MHz  [HC49/4H]

### Ports
3V3, GND, P0(0), P0(1), P0(2), P0(3), P0(4), P0(5), P0(6), P0(7), P0(8), P0(9), P0(10), P0(11), P0(15), P0(16), P0(17), P0(18), P0(19), P0(20), P0(21), P0(22), P0(23), P0(24), P0(25), P0(26), P0(27), P0(28), P0(29), P0(30), P1(0), P1(1), P1(4), P1(8), P1(9), P1(10), P1(14), P1(15), P1(16), P1(17), P1(18), P1(19), P1(20), P1(21), P1(22), P1(23), P1(24), P1(25), P1(26), P1(27), P1(28), P1(29), P1(30), P1(31), P2(0), P2(1), P2(2), P2(3), P2(4), P2(5), P2(6), P2(7), P2(8), P2(9), P2(10), P2(11), P2(12), P2(13), P3(25), P3(26), P4(28), P4(29), VBAT (in), ~{RESET} (in), ~{RSTOU}T (out)

### Nets
VDDA: C12.2 C13.1 C14.1 C18.1 C19.2 C21.1 C22.2 C23.1 C24.2 C25.1 C26.1 J4.1 J4.2 R11.2 R12.2 R13.2 R14.2 R15.2 U10.10(VDDA) U10.12(VREFP) U10.28(VDD(3V3)) U10.42(VDD(REG)(3V3)) U10.54(VDD(3V3)) U10.71(VDD(3V3)) U10.84(VDD(REG)(3V3)) U10.96(VDD(3V3)) ; port 3V3  [also labelled 3V3, VREFP]
VREFN: C12.1 C13.2 C14.2 C15.2 C16.2 C17.2 C18.2 C19.1 C20.2 C21.2 C22.1 C23.2 C24.1 C25.2 C26.2 J4.4 J4.6 J4.8 J4.10 J4.12 J4.14 J4.16 J4.18 J4.20 R16.1 R17.1 R18.1 R19.1 U10.11(VSSA) U10.15(VREFN) U10.31(VSS) U10.41(VSS) U10.55(VSS) U10.72(VSS) U10.83(VSS) U10.97(VSS) ; port GND  [also labelled GND, VSSA]
DBGACK: J4.19 R19.2
DBGRQ: J4.17 R18.2
LPC_CLK: U10.62(P0[15]_/_TXD1_/_SCK0_/_SCK) ; port P0(15)
LPC_CS: U10.63(P0[16]_/_RXD1_/_SSEL0_/_SSEL) ; port P0(16)
LPC_MISO: U10.61(P0[17]_/_CTS1_/_MISO0_/_MISO) ; port P0(17)
LPC_MOSI: U10.60(P0[18]_/_DCD1_/_MOSI0_/_MOSI) ; port P0(18)
LPC_RX: U10.74(P2[1]_/_PWM1[2]_/_RXD1) ; port P2(1)
LPC_TX: U10.75(P2[0]_/_PWM1[1]_/_TXD1) ; port P2(0)
~{PFO}: U10.57(P0[21]_/_RI1_/_RD1) ; port P0(21)
RTCK: J4.11 R17.2 U10.100(RTCK)
RTCX1: C15.1 U10.16(RTCX1) Y1.2
RTCX2: C16.1 U10.18(RTCX2) Y1.1
SRST: J4.15 R11.1 U10.17(RESET) ; port ~{RESET}
TCK: J4.9 R16.2 U10.5(TCLK/SWDCLK)
TDI: J4.5 R14.1 U10.2(TDI)
TDO: J4.13 R12.1 U10.1(TDO)
TMS: J4.7 R13.1 U10.3(TMS/SWDIO)
TRST: J4.3 R15.1 U10.4(TRST)
UART1_RXD: U10.98(P0[2]_/_TXD0_/_AD0[7]) ; port P0(2)
VBATT: U10.19(VBAT) ; port VBAT
XTAL1: C17.1 U10.22(XTAL1) Y2.1
XTAL2: C20.1 U10.23(XTAL2) Y2.2
NetC35_1: U10.20(P1[31]_/_SCK1_/_AD0[5]) ; port P1(31)
NetC36_1: U10.21(P1[30]_/_VBUS_/_AD0[4]) ; port P1(30)
NetR4_2: U10.14(RSTOUT) ; port ~{RSTOU}T
NetR39_1: U10.32(P1[18]_/_USB_UP_LED_/_PWM1[1]_/_CAP1[0]) ; port P1(18)
NetR43_1: U10.34(P1[20]_/_MCI0_/_PWM1[2]_/_SCK0) ; port P1(20)
NetTP3_0: U10.66(P2[7]_/_RD2_/_RTS1) ; port P2(7)
NetTP4_0: U10.65(P2[8]_/_TD2_/_TXD2_/_ENET_MDC) ; port P2(8)
NetTP19_0: U10.99(P0[3]_/_RXD0_/_AD0[6]) ; port P0(3)
NetTP28_0: U10.43(P1[27]_/_CLKOUT_/_USB_OVRCR_/_CAP0[1]) ; port P1(27)
NetTP29_0: U10.51(P2[12]_/_EINT2_/_I2STX_WS) ; port P2(12)
NetU10_6: U10.6(P0[26]_/_AD0[3]_/_AOUT_/_RXD3) ; port P0(26)
NetU10_7: U10.7(P0[25]_/_AD0[2]_/_I2SRX_SDA_/_TXD3) ; port P0(25)
NetU10_8: U10.8(P0[24]_/_AD0[1]_/_I2SRX_WS_/_CAP3[1]) ; port P0(24)
NetU10_9: U10.9(P0[23]_/_AD0[0]_/_I2SRX_CLK_/_CAP3[0]) ; port P0(23)
NetU10_24: U10.24(P0[28]_/_SCL0_/_USB_SCL) ; port P0(28)
NetU10_25: U10.25(P0[27]_/_SDA0_/_USB_SDA) ; port P0(27)
NetU10_26: U10.26(P3[26]_/_STCLK_/_MAT0[1]_/_PWM1[3]) ; port P3(26)
NetU10_27: U10.27(P3[25]_/_MAT0[0]_/_PWM1[2]) ; port P3(25)
NetU10_29: U10.29(P0[29]_/_USB_D+) ; port P0(29)
NetU10_30: U10.30(P0[30]_/_USB_D-) ; port P0(30)
NetU10_33: U10.33(P1[19]_/_MCOA0_/_USB_PPWR_/_CAP1[1]) ; port P1(19)
NetU10_35: U10.35(P1[21]_/_MCABORT_/_PWM1[3]_/_SSEL0) ; port P1(21)
NetU10_36: U10.36(P1[22]_/_MCOB0_/_USB_PWRD_/_MAT1[0]) ; port P1(22)
NetU10_37: U10.37(P1[23]_/_MCI1_/_PWM1[4]_/_MISO0) ; port P1(23)
NetU10_38: U10.38(P1[24]_/_MCI2_/_PWM1[5]_/_MOSI0) ; port P1(24)
NetU10_39: U10.39(P1[25]_/_MCOA1_/_MAT1[1]) ; port P1(25)
NetU10_40: U10.40(P1[26]_/_MCOB1_/_PWM1[6]_/_CAP0[0]) ; port P1(26)
NetU10_44: U10.44(P1[28]_/_MCOA2_/_PCAP1[0]_/_MAT0[0]) ; port P1(28)
NetU10_45: U10.45(P1[29]_/_MCOB2_/_PCAP1[1]_/_MAT0[1]) ; port P1(29)
NetU10_46: U10.46(P0[0]_/_RD1_/_TXD3_/_SDA1) ; port P0(0)
NetU10_47: U10.47(P0[1]_/_TD1_/_RXD3_/_SCL1) ; port P0(1)
NetU10_48: U10.48(P0[10]_/_TXD2_/_SDA2_/_MAT3[0]) ; port P0(10)
NetU10_49: U10.49(P0[11]_/_RXD2_/_SCL2_/_MAT3[1]) ; port P0(11)
NetU10_50: U10.50(P2[13]_/_EINT3_/_I2STX_SDA) ; port P2(13)
NetU10_52: U10.52(P2[11]_/_EINT1_/_I2STX_CLK) ; port P2(11)
NetU10_53: U10.53(P2[10]_/_EINT0_/_NMI) ; port P2(10)
NetU10_56: U10.56(P0[22]_/_RTS1_/_TD1) ; port P0(22)
NetU10_58: U10.58(P0[20]_/_DTR1_/_SCL1) ; port P0(20)
NetU10_59: U10.59(P0[19]_/_DSR1_/_SDA1) ; port P0(19)
NetU10_64: U10.64(P2[9]_/_USB_CONNECT_/_RXD2_/_ENET_MDIO) ; port P2(9)
NetU10_67: U10.67(P2[6]_/_PCAP1[0]_/_RI1_/_TRACECLK) ; port P2(6)
NetU10_68: U10.68(P2[5]_/_PWM1[6]_/_DTR1_/_TRACEDATA[0]) ; port P2(5)
NetU10_69: U10.69(P2[4]_/_PWM1[5]_/_DSR1_/_TRACEDATA[1]) ; port P2(4)
NetU10_70: U10.70(P2[3]_/_PWM1[4]_/_DCD1_/_TRACEDATA[2]) ; port P2(3)
NetU10_73: U10.73(P2[2]_/_PWM1[3]_/_CTS1_/_TRACEDATA[3]) ; port P2(2)
NetU10_76: U10.76(P0[9]_/_I2STX_SDA_/_MOSI1_/_MAT2[3]) ; port P0(9)
NetU10_77: U10.77(P0[8]_/_I2STX_WS_/_MISO1_/_MAT2[2]) ; port P0(8)
NetU10_78: U10.78(P0[7]_/_I2STX_CLK_/_SCK1_/_MAT2[1]) ; port P0(7)
NetU10_79: U10.79(P0[6]_/_I2SRX_SDA_/_SSEL1_/_MAT2[0]) ; port P0(6)
NetU10_80: U10.80(P0[5]_/_I2SRX_WS_/_TD2_/_CAP2[1]) ; port P0(5)
NetU10_81: U10.81(P0[4]_/_I2SRX_CLK_/_RD2_/_CAP2[0]) ; port P0(4)
NetU10_82: U10.82(P4[28]_/_RX_MCLK_/_MAT2[0]_/_TXD3) ; port P4(28)
NetU10_85: U10.85(P4[29]_/_TX_MCLK_/_MAT2[1]_/_RXD3) ; port P4(29)
NetU10_86: U10.86(P1[17]_/_ENET_MDIO) ; port P1(17)
NetU10_87: U10.87(P1[16]_/_ENET_MDC) ; port P1(16)
NetU10_88: U10.88(P1[15]_/_ENET_REF_CLK) ; port P1(15)
NetU10_89: U10.89(P1[14]_/_ENET_RX_ER) ; port P1(14)
NetU10_90: U10.90(P1[10]_/_ENET_RXD1) ; port P1(10)
NetU10_91: U10.91(P1[9]_/_ENET_RXD0) ; port P1(9)
NetU10_92: U10.92(P1[8]_/_ENET_CRS) ; port P1(8)
NetU10_93: U10.93(P1[4]_/_ENET_TX_EN) ; port P1(4)
NetU10_94: U10.94(P1[1]_/_ENET_TXD1) ; port P1(1)
NetU10_95: U10.95(P1[0]_/_ENET_TXD0) ; port P1(0)

Not connected (* = marked no-connect by the designer): U10 13(NC)*

### Notes on the sheet
- 18pF from datasheet, do not substitute
- Title
- Size:
- Date:
- A4
- Number:
- Time:
- Revision:
- Sheet
- of
- File:

### Library data of the parts
C12 C13 C18 C19 C22-C24 C26 = CAP: Capacitor; Farnell: 753-567; Price: 0.30
C14 C21 C25 = CAP POL3: Polarized Capacitor (Surface Mount); Revision: July-2002: Re-released for DXP Platform.; Digikey: 399-3687-1-ND; DigikeyPrice: 0.54; Farnell: 1650980; FarnellPrice: 0.786
C15-C17 C20 = CAP: Capacitor; Order#: 721-992; Price: 0.11; Supplier: Farnell
J4 = Header 10X2: Header, 10-Pin, Dual row; Farnell: 9733647; FarnellPrice: 3.38; Digikey: WM8146-ND; DigikeyPrice: 3.39
R11-R19 = RES1: Resistor
U10 = LPC1768: NXP Cortex-M3 Microcontroller, 100pin 100MHz; Farnell: 1718549; FarnellPrice: 18.94; Digikey: 568-4796-ND; DigikeyPrice: 11.44
Y1 Y2 = CRYSTAL
  Y1: Farnell: 1611828; FarnellPrice: 0.401; Digikey: 535-9032-ND; DigikeyPrice: 0.25
  Y2: Farnell: 7940142; FarnellPrice: 0.854; DigikeyPrice: 0.46; Digikey: 887-1013-ND

## Sheet can_transciever_dualvolt_isolated.SchDoc: Dual Isolated CAN transciever
size A4; Organization: UNSW Solar Racing Team; Address3: UNSW; Address4: Sydney NSW 2052; Address2: Electrical Engineering; Address1: Rm 109
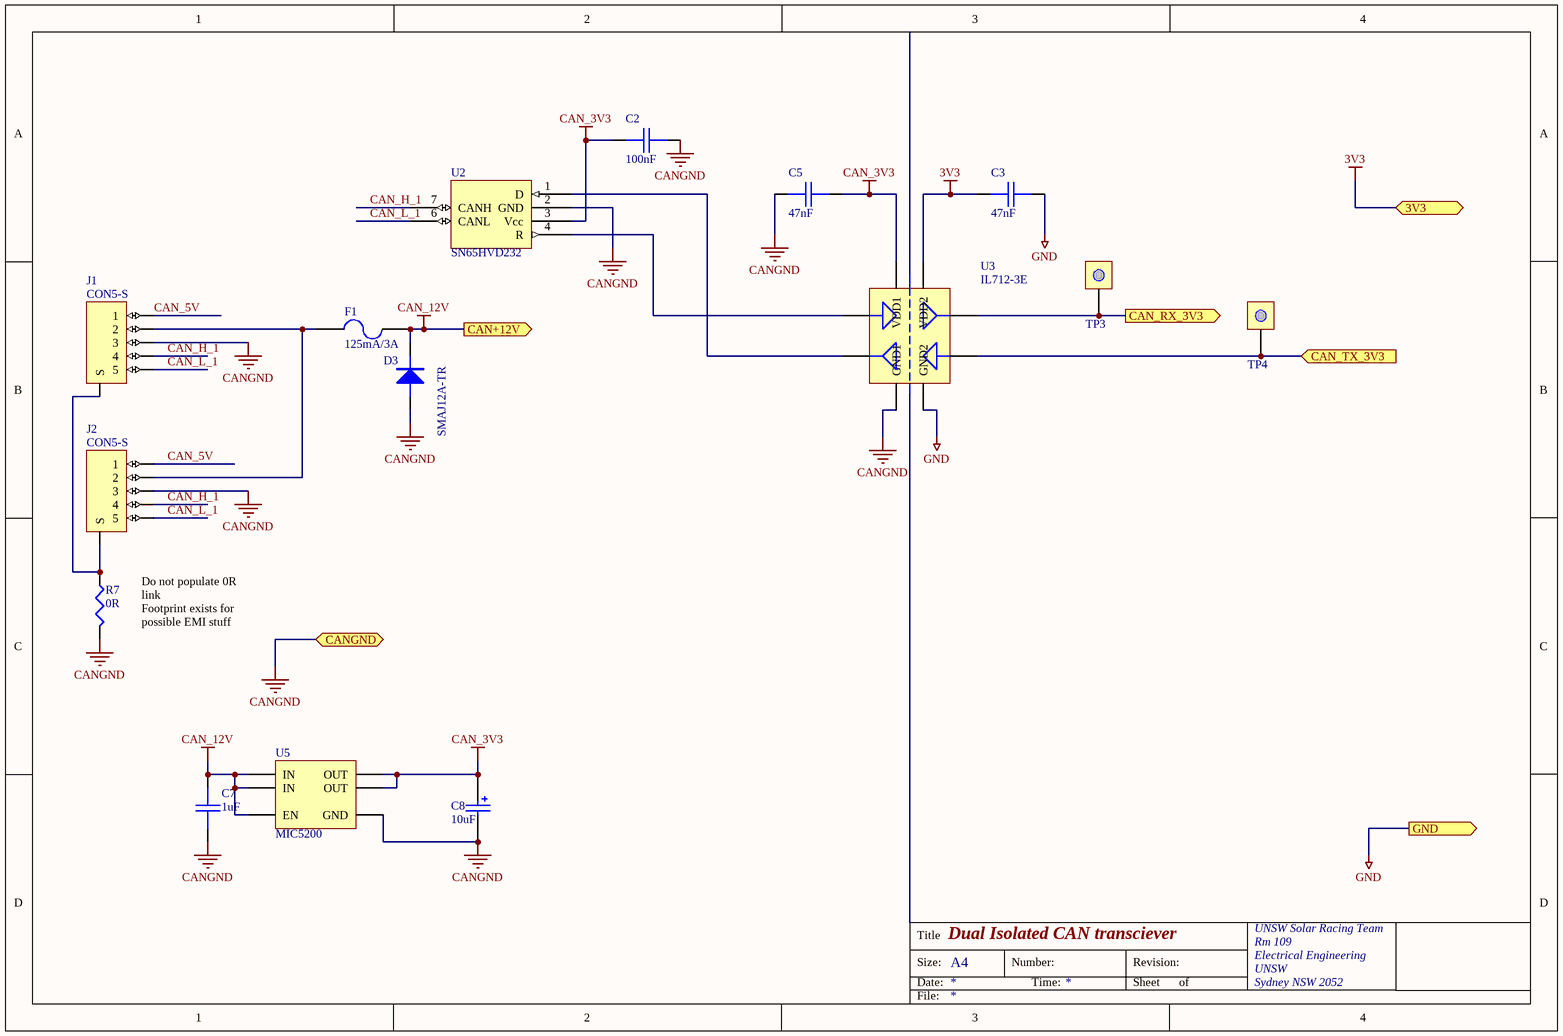
[diagram p6: can_transciever_dualvolt_isolated.SchDoc]

### Parts
C2  100nF  [0603]
C3  47nF  [0603]
C5  47nF  [0603]
C7  1uF  [0805]
C8  10uF  [MCCT-CASEA]
D3  SMAJ12A-TR  [SMA]
F1  125mA/3A  [LITTELFUSE-154]
J1  CON5-S  [TRIAD5F]
J2  CON5-S  [TRIAD5F]
R7  0R  [1206]
TP3  RX  [TESTPOINT]  (value not drawn)
TP4  TX  [TESTPOINT]  (value not drawn)
U2  SN65HVD232  [SO8]
U3  IL712-3E  [SO8]
U5  MIC5200  [SO8]

### Ports
3V3, CAN+12V (out), CAN_RX_3V3 (out), CAN_TX_3V3 (in), CANGND, GND (out)

### Nets
3V3: C3.1 U3.8(VDD2) ; port 3V3  [project net VDDA]
CAN_3V3: C2.1 C5.2 C8.1 U2.3(Vcc) U3.1(VDD1) U5.1(OUT) U5.2(OUT)
CAN_12V: C7.1 D3.K F1.2 U5.5(EN) U5.7(IN) U5.8(IN) ; port CAN+12V
CANGND: C2.2 C5.1 C7.2 C8.2 D3.A J1.3 J2.3 R7.2 U2.2(GND) U3.4(GND1) U5.4(GND) ; port CANGND
GND: C3.2 U3.5(GND2) ; port GND  [project net VREFN]
CAN_5V: J1.1 J2.1
CAN_H_1: J1.4 J2.4 U2.7(CANH)
CAN_L_1: J1.5 J2.5 U2.6(CANL)
NetF1_1: F1.1 J1.2 J2.2
NetJ1_0: J1.0(S) J2.0(S) R7.1
NetTP3_0: TP3.0(TP) U3.7(OUT1) ; port CAN_RX_3V3
NetTP4_0: TP4.0(TP) U3.6(IN2) ; port CAN_TX_3V3
NetU2_1: U2.1(D) U3.3(OUT2)
NetU2_4: U2.4(R) U3.2(IN1)

### Notes on the sheet
- Do not populate 0R link
  Footprint exists for possible EMI stuff
- Title
- Size:
- Date:
- A4
- Number:
- Time:
- Revision:
- Sheet
- of
- File:

### Library data of the parts
C2 C3 C5 C7 = CAP: Capacitor
  C3 C5: Farnell: 8820015; Digikey: 490-3287-1-ND; DigikeyPrice: 0.053; FarnellPrice: 0.085
C8 = CAP POL3: Polarized Capacitor (Surface Mount); Revision: July-2002: Re-released for DXP Platform.; Digikey: 399-3687-1-ND; DigikeyPrice: 0.54; Farnell: 1650980; FarnellPrice: 0.786
D3 = DIODE: 12V TVS Diode; Farnell: 9802754; FarnellPrice: 0.502; Digikey: 497-6503-1-ND; DigikeyPrice: 0.61
F1 = FUSE2: Fuse; Farnell: 9943749; FarnellPrice: 5.82; Digikey: F1307CT-ND; DigikeyPrice: 3.49
J1 J2 = CON5-S: Connector, 2 pin, with shield @ S; RS: 259-0993; RSPrice: 26.2; Farnell: 131-040; FarnellPrice: 32.75
R7 = RES1: Resistor
TP3 TP4 = TEST: TEST POINT
U2 = SN65HVD232: 3.3V CAN Transciever; Farnell: 1103107; FarnellPrice: 5.1; Digikey: 296-12282-5-ND; DigikeyPrice: 3.36
U3 = IL712: IL712 Optical Isolator; Digikey: 390-1061-5-ND; DigikeyPrice: 5.86; Farnell: 9570608; FarnellPrice: 9.4
U5 = MIC5200: MIC5200 - SO8; Part Field 2: 2.00; Part Field 3: Computer Science and Engineering; Part Field 4: David Johnson; Farnell: 1213488; FarnellPrice: 3.62; Digikey: 576-1246-ND; DigikeyPrice: 2.1

## Sheet usb_isolated_uart_x2.SchDoc
size A4; Organization: UNSW Solar Racing Team; Address3: UNSW; Address4: Sydney NSW 2052; Address2: Electrical Engineering; Address1: Room 342
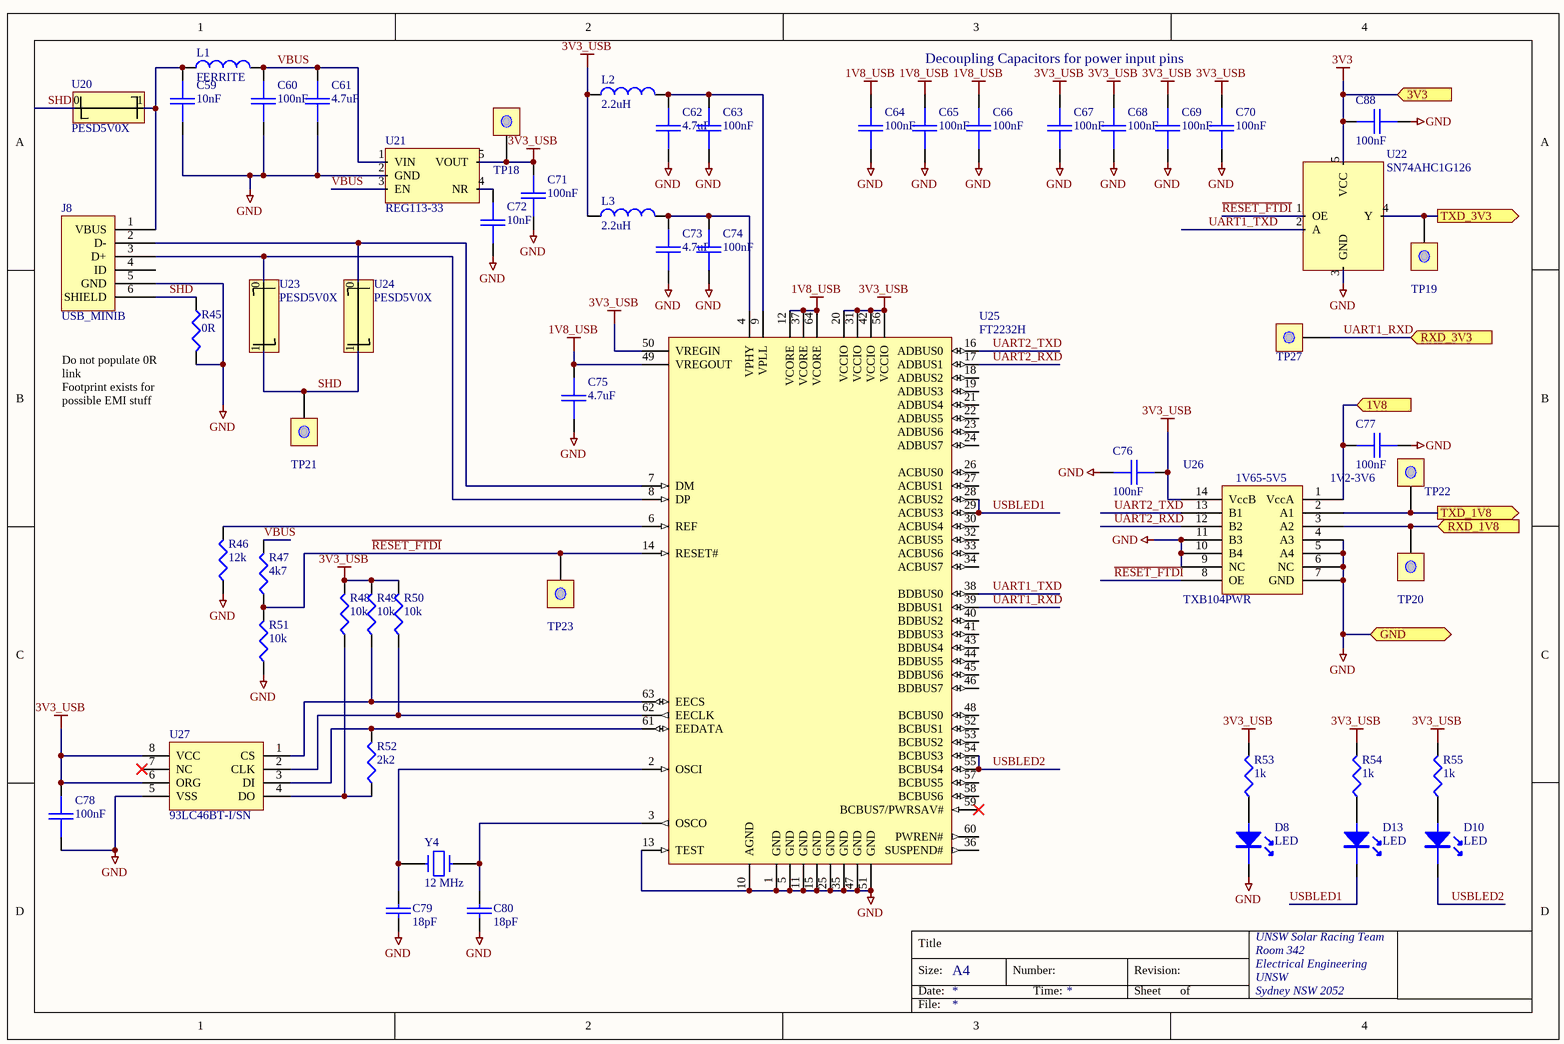
[diagram p7: usb_isolated_uart_x2.SchDoc]

### Parts
C59  10nF  [0603]
C60  100nF  [0603]
C61  4.7uF  [0603]
C62  4.7uF  [0603]
C63  100nF  [0603]
C64  100nF  [0603]
C65  100nF  [0603]
C66  100nF  [0603]
C67  100nF  [0603]
C68  100nF  [0603]
C69  100nF  [0603]
C70  100nF  [0603]
C71  100nF  [0603]
C72  10nF  [0603]
C73  4.7uF  [0603]
C74  100nF  [0603]
C75  4.7uF  [0603]
C76  100nF  [0603]
C77  100nF  [0603]
C78  100nF  [0603]
C79  18pF  [0603]
C80  18pF  [0603]
C88  100nF  [0603]
D8  LED  [0805LED]
D10  LED  [0805LED]
D13  LED  [0805LED]
J8  USB_MINIB  [USB_MINIB]
L1  FERRITE  [0603]
L2  2.2uH  [1210]
L3  2.2uH  [1210]
R45  0R  [1206]
R46  12k  [0603]
R47  4k7  [0603]
R48  10k  [0603]
R49  10k  [0603]
R50  10k  [0603]
R51  10k  [0603]
R52  2k2  [0603]
R53  1k  [0603]
R54  1k  [0603]
R55  1k  [0603]
TP18  3V3USB  [TESTPOINT]  (value not drawn)
TP19  TXD3V3  [TESTPOINT]  (value not drawn)
TP20  RXD1V8  [TESTPOINT]  (value not drawn)
TP21  SHD  [TESTPOINT]  (value not drawn)
TP22  TXD1V8  [TESTPOINT]  (value not drawn)
TP23  FTDI_RST  [TESTPOINT]  (value not drawn)
TP27  RXD3V3  [TESTPOINT]  (value not drawn)
U20  PESD5V0X  [SOD323]
U21  REG113-33  [SOT23-5]
U22  SN74AHC1G126  [SOT23-5]
U23  PESD5V0X  [SOD323]
U24  PESD5V0X  [SOD323]
U25  FT2232H  [QFP64]
U26  TXB104PWR  [TSSOP14-L]
U27  93LC46BT-I/SN  [SO8]
Y4  12 MHz  [HC49/4H]

### Ports
1V8 (in), 3V3 (in), GND, RXD_1V8 (in), RXD_3V3 (in), TXD_1V8 (out), TXD_3V3 (out)

### Nets
1V8: C77.1 U26.1(VccA) ; port 1V8
1V8_USB: C64.1 C65.1 C66.1 C75.1 U25.12(VCORE) U25.37(VCORE) U25.49(VREGOUT) U25.64(VCORE)
3V3: C88.2 U22.5(VCC) ; port 3V3  [project net VDDA]
3V3_USB: C67.1 C68.1 C69.1 C70.1 C71.1 C76.2 C78.1 L2.1 L3.1 R48.2 R49.2 R50.2 R53.2 R54.2 R55.2 TP18.0(TP) U21.5(VOUT) U25.20(VCCIO) U25.31(VCCIO) U25.42(VCCIO) U25.50(VREGIN) U25.56(VCCIO) U26.14(VccB) U27.6(ORG) U27.8(VCC)
GND: C59.1 C60.2 C61.2 C62.2 C63.2 C64.2 C65.2 C66.2 C67.2 C68.2 C69.2 C70.2 C71.2 C72.2 C73.2 C74.2 C75.2 C76.1 C77.2 C78.2 C79.2 C80.2 C88.1 D8.K J8.5(GND) R45.2 R46.1 R51.1 U21.2(GND) U22.3(GND) U25.1(GND) U25.5(GND) U25.10(AGND) U25.11(GND) U25.13(TEST) U25.15(GND) U25.25(GND) U25.35(GND) U25.47(GND) U25.51(GND) U26.4(A3) U26.5(A4) U26.6(NC) U26.7(GND) U26.9(NC) U26.10(B4) U26.11(B3) U27.5(VSS) ; port GND  [project net VREFN]
~{RESET_FTDI}: R47.1 R51.2 TP23.0(TP) U22.1(OE) U25.14(RESET#) U26.8(OE)
SHD: J8.6(SHIELD) R45.1 TP21.0(TP) U20.0 U23.1 U24.1
UART1_RXD: TP27.0(TP) U25.39(BDBUS1) ; port RXD_3V3
UART1_TXD: U22.2(A) U25.38(BDBUS0)
UART2_RXD: U25.17(ADBUS1) U26.12(B2)
UART2_TXD: U25.16(ADBUS0) U26.13(B1)
USBLED1: D13.K U25.28(ACBUS2) U25.29(ACBUS3)
USBLED2: D10.K U25.54(BCBUS3) U25.55(BCBUS4)
VBUS: C60.1 C61.1 L1.2 R47.2 U21.1(VIN) U21.3(EN)
NetC59_2: C59.2 J8.1(VBUS) L1.1 U20.1
NetC62_1: C62.1 C63.1 L2.2 U25.9(VPLL)
NetC72_1: C72.1 U21.4(NR)
NetC73_1: C73.1 C74.1 L3.2 U25.4(VPHY)
NetC79_1: C79.1 U25.2(OSCI) Y4.2
NetC80_1: C80.1 U25.3(OSCO) Y4.1
NetD8_A: D8.A R53.1
NetD10_A: D10.A R55.1
NetD13_A: D13.A R54.1
NetJ8_2: J8.2(D-) U24.0 U25.7(DM)
NetJ8_3: J8.3(D+) U23.0 U25.8(DP)
NetR46_2: R46.2 U25.6(REF)
NetR48_1: R48.1 R52.1 U27.4(DO)
NetR49_1: R49.1 U25.63(EECS) U27.1(CS)
NetR50_1: R50.1 U25.62(EECLK) U27.2(CLK)
NetR52_2: R52.2 U25.61(EEDATA) U27.3(DI)
NetTP19_0: TP19.0(TP) U22.4(Y) ; port TXD_3V3
NetTP20_0: TP20.0(TP) U26.3(A2) ; port RXD_1V8
NetTP22_0: TP22.0(TP) U26.2(A1) ; port TXD_1V8

Not connected (* = marked no-connect by the designer): J8 4(ID); U25 18(ADBUS2) 19(ADBUS3) 21(ADBUS4) 22(ADBUS5) 23(ADBUS6) 24(ADBUS7) 26(ACBUS0) 27(ACBUS1) 30(ACBUS4) 32(ACBUS5) 33(ACBUS6) 34(ACBUS7) 36(SUSPEND#) 40(BDBUS2) 41(BDBUS3) 43(BDBUS4) 44(BDBUS5) 45(BDBUS6) 46(BDBUS7) 48(BCBUS0) 52(BCBUS1) 53(BCBUS2) 57(BCBUS5) 58(BCBUS6) 59(BCBUS7/PWRSAV#)* 60(PWREN#); U27 7(NC)*

### Notes on the sheet
- Decoupling Capacitors for power input pins
- (near R45) Do not populate 0R link
  Footprint exists for possible EMI stuff
- Title
- Size:
- Date:
- A4
- Number:
- Time:
- Revision:
- Sheet
- of
- File:
- (in symbol TXB0104PWR) 1V65-5V5; 1V2-3V6

### Library data of the parts
C59-C78 C88 = CAP: Capacitor
  C61 C62 C73 C75: Digikey: 587-1441-1-ND; Farnell: 1688134; DigikeyPrice: 0.42; FarnellPrice: 0.585
C79 C80 = CAP: Capacitor; Order#: 721-992; Price: 0.11; Supplier: Farnell
J8 = USB_miniB_SMT: USB Mini B Connector; Farnell: 9786473; Digikey: H2961CT-ND; DigikeyPrice: 1.18; FarnellPrice: 3.08
L1-L3 = INDUCTOR: Revision: July-2002: Re-released for DXP Platform.
  L1: Digikey: 732-2389-1-ND; DigikeyPrice: 0.42; Farnell: 1748581; FarnellPrice: 0.567
  L2 L3: Farnell: 1198477; FarnellPrice: 0.353; Digikey: PCD1488CT-ND; DigikeyPrice: 0.22
R45-R55 = RES1: Resistor
  R46: Farnell: 1795293; FarnellPrice: 0.087; Digikey: P12.0KHCT-ND; DigikeyPrice: 0.04
  R47-R51 R53-R55: Farnell: Stock
  R52: Digikey: P2.20KHCT-ND; DigikeyPrice: 0.04
TP18-TP23 TP27 = TEST: TEST POINT
U20 U23 U24 = PESD5V0X: Ultra low capacitance bidirectional ESD protection diodes; Digikey: 568-4673-1-ND; Farnell: 8737606; FarnellPrice: 1.06
U21 = REG113-33: 400mA Low-Dropout Regulator; Digikey: REG113NA-3.3/3KCT-ND; DigikeyPrice: 3.15; Farnell: 1652375; FarnellPrice: 5.6
U22 = SN74AHC1G126: Single Bus Buffer Gate with 3 State Output; Digikey: 296-8746-1-ND; DigikeyPrice: 0.53; FArnell: 1287410; FarnellPrice: 0.85
U25 = FT2232H: Dual USB to UART/FIFO; Digikey: 768-1024-1-ND; Farnell: 1697461; DigikeyPrice: 6.71; FarnellPrice: 17.73
U26 = TXB0104PWR: 4 bit bidirectional auto direction sense level translator; Digikey: 296-21929-1-ND; Farnell: 1607891; FarnellPrice: 3.1; DigikeyPrice: 1.93
U27 = 93LC46BT-I/SN: Serial EEPROM; Digikey: 93LC46BT-I/SNCT-ND; Farnell: 1296585; FarnellPrice: 0.546; DigikeyPrice: 0.34
Y4 = CRYSTAL: Order#: 7940142; Price: 0.662; Supplier: Farnell
D8 D10 D13 = LED
  D8: Farnell: *; Digikey: 475-1151-1-ND; DigikeyPrice: 0.28
  D10: Digikey: 475-2676-1-ND; DigikeyPrice: 0.21
  D13: Farnell: *; Digikey: 475-2690-1-ND; DigikeyPrice: 0.21

## Sheet Gumstix_Overo.SchDoc
size A4
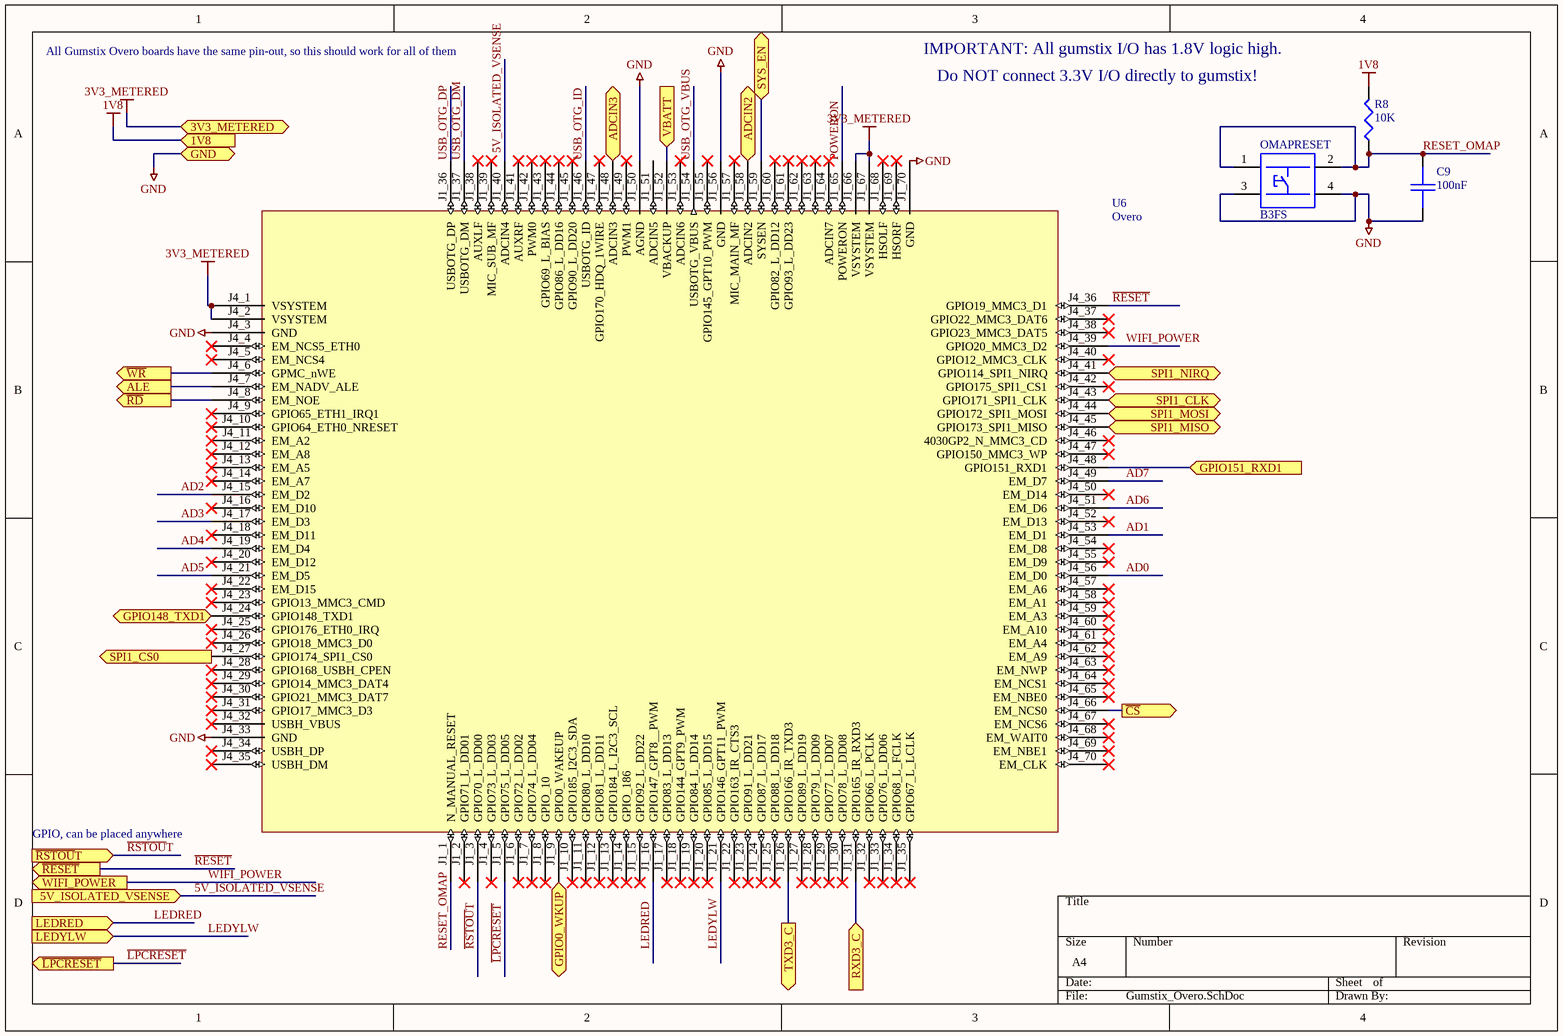
[diagram p8: Gumstix_Overo.SchDoc]

### Parts
C9  100nF  [0603]
OMAPRESET  B3FS  [B3FS-1052]
R8  10K  [0603]
U6  Overo  [Overo-bare]

### Ports
1V8 (in), 3V3_METERED, 5V_ISOLATED_VSENSE (in), ADCIN2 (in), ADCIN3 (in), ALE (out), GND, GPIO0_WKUP (bidir), GPIO148_TXD1 (out), GPIO151_RXD1 (in), LEDRED (in), LEDYLW (in), RXD3_C (in), SPI1_CLK (out), SPI1_CS0 (out), SPI1_MISO (in), SPI1_MOSI (out), SPI1_NIRQ (in), SYS_EN (bidir), TXD3_C (out), VBATT (in), WIFI_POWER (out), ~{CS} (out), ~{LPCRESET} (out), ~{RD} (out), ~{RESET} (out), ~{RSTOU}T (in), ~{WR} (out)

### Nets
1V8: R8.2 ; port 1V8
3V3_METERED: U6.J1_66(VSYSTEM) U6.J1_67(VSYSTEM) U6.J4_1(VSYSTEM) U6.J4_2(VSYSTEM) ; port 3V3_METERED  [project net VDDA]
GND: C9.2 OMAPRESET.3(B2) OMAPRESET.4(B1) U6.J1_50(AGND) U6.J1_56(GND) U6.J1_70(GND) U6.J4_3(GND) U6.J4_33(GND) ; port GND  [project net VREFN]
5V_ISOLATED_VSENSE: U6.J1_40(ADCIN4) ; port 5V_ISOLATED_VSENSE
AD0: U6.J4_56(EM_D0)
AD1: U6.J4_53(EM_D1)
AD2: U6.J4_15(EM_D2)
AD3: U6.J4_17(EM_D3)
AD4: U6.J4_19(EM_D4)
AD5: U6.J4_21(EM_D5)
AD6: U6.J4_51(EM_D6)
AD7: U6.J4_49(EM_D7)
~{LPCRESET}: U6.J1_5(GPIO75_L_DD05) ; port ~{LPCRESET}
LEDRED: U6.J1_16(GPIO147_GPT8__PWM) ; port LEDRED
LEDYLW: U6.J1_21(GPIO146_GPT11_PWM) ; port LEDYLW
POWERON: U6.J1_65(POWERON)
~{RESET}: U6.J4_36(GPIO19_MMC3_D1) ; port ~{RESET}
~{RSTOU}T: U6.J1_3(GPIO70_L_DD00) ; port ~{RSTOU}T
RESET_OMAP: C9.1 OMAPRESET.1(A1) OMAPRESET.2(A2) R8.1 U6.J1_1(N_MANUAL_RESET)
USB_OTG_DM: U6.J1_37(USBOTG_DM)
USB_OTG_DP: U6.J1_36(USBOTG_DP)
USB_OTG_ID: U6.J1_46(USBOTG_ID)
USB_OTG_VBUS: U6.J1_54(USBOTG_VBUS)
VBATT: U6.J1_52(VBACKUP) ; port VBATT
WIFI_POWER: U6.J4_39(GPIO20_MMC3_D2) ; port WIFI_POWER
NetTP16_0: U6.J1_59(SYSEN) ; port SYS_EN
NetTP17_0: U6.J1_9(GPIO0_WAKEUP) ; port GPIO0_WKUP
NetTP20_0: U6.J1_26(GPIO166_IR_TXD3) ; port TXD3_C
NetTP22_0: U6.J1_31(GPIO165_IR_RXD3) ; port RXD3_C
NetTP30_0: U6.J4_41(GPIO114_SPI1_NIRQ) ; port SPI1_NIRQ
NetU6_J1_48: U6.J1_48(ADCIN3) ; port ADCIN3
NetU6_J1_58: U6.J1_58(ADCIN2) ; port ADCIN2
NetU6_J4_6: U6.J4_6(GPMC_nWE) ; port ~{WR}
NetU6_J4_7: U6.J4_7(EM_NADV_ALE) ; port ALE
NetU6_J4_8: U6.J4_8(EM_NOE) ; port ~{RD}
NetU6_J4_24: U6.J4_24(GPIO148_TXD1) ; port GPIO148_TXD1
NetU6_J4_27: U6.J4_27(GPIO174_SPI1_CS0) ; port SPI1_CS0
NetU6_J4_43: U6.J4_43(GPIO171_SPI1_CLK) ; port SPI1_CLK
NetU6_J4_44: U6.J4_44(GPIO172_SPI1_MOSI) ; port SPI1_MOSI
NetU6_J4_45: U6.J4_45(GPIO173_SPI1_MISO) ; port SPI1_MISO
NetU6_J4_48: U6.J4_48(GPIO151_RXD1) ; port GPIO151_RXD1
NetU6_J4_66: U6.J4_66(EM_NCS0) ; port ~{CS}

Not connected (* = marked no-connect by the designer): U6 J1_2(GPIO71_L_DD01)* J1_4(GPIO73_L_DD03)* J1_6(GPIO72_L_DD02)* J1_7(GPIO74_L_DD04)* J1_8(GPIO_10)* J1_10(GPIO185_I2C3_SDA)* J1_11(GPIO80_L_DD10)* J1_12(GPIO81_L_DD11)* J1_13(GPIO184_L_I2C3_SCL)* J1_14(GPIO_186)* J1_15(GPIO92_L_DD22)* J1_17(GPIO83_L_DD13)* J1_18(GPIO144_GPT9_PWM)* J1_19(GPIO84_L_DD14)* J1_20(GPIO85_L_DD15)* J1_22(GPIO163_IR_CTS3)* J1_23(GPIO91_L_DD21)* J1_24(GPIO87_L_DD17)* J1_25(GPIO88_L_DD18)* J1_27(GPIO89_L_DD19)* J1_28(GPIO79_L_DD09)* J1_29(GPIO77_L_DD07)* J1_30(GPIO78_L_DD08)* J1_32(GPIO66_L_PCLK)* J1_33(GPIO76_L_DD06)* J1_34(GPIO68_L_FCLK)* J1_35(GPIO67_L_LCLK)* J1_38(AUXLF)* J1_39(MIC_SUB_MF)* J1_41(AUXRF)* J1_42(PWM0)* J1_43(GPIO69_L_BIAS)* J1_44(GPIO86_L_DD16)* J1_45(GPIO90_L_DD20)* J1_47(GPIO170_HDQ_1WIRE)* J1_49(PWM1)* J1_51(ADCIN5) J1_53(ADCIN6)* J1_55(GPIO145_GPT10_PWM)* J1_57(MIC_MAIN_MF)* J1_60(GPIO82_L_DD12)* J1_61(GPIO93_L_DD23)* J1_62* J1_63* J1_64(ADCIN7)* J1_68(HSOLF)* J1_69(HSORF)* J4_4(EM_NCS5_ETH0)* J4_5(EM_NCS4)* J4_9(GPIO65_ETH1_IRQ1)* J4_10(GPIO64_ETH0_NRESET)* J4_11(EM_A2)* J4_12(EM_A8)* J4_13(EM_A5)* J4_14(EM_A7)* J4_16(EM_D10)* J4_18(EM_D11)* J4_20(EM_D12)* J4_22(EM_D15)* J4_23(GPIO13_MMC3_CMD)* J4_25(GPIO176_ETH0_IRQ)* J4_26(GPIO18_MMC3_D0)* J4_28(GPIO168_USBH_CPEN)* J4_29(GPIO14_MMC3_DAT4)* J4_30(GPIO21_MMC3_DAT7)* J4_31(GPIO17_MMC3_D3)* J4_32(USBH_VBUS)* J4_34(USBH_DP)* J4_35(USBH_DM)* J4_37(GPIO22_MMC3_DAT6)* J4_38(GPIO23_MMC3_DAT5)* J4_40(GPIO12_MMC3_CLK)* J4_42(GPIO175_SPI1_CS1)* J4_46(4030GP2_N_MMC3_CD)* J4_47(GPIO150_MMC3_WP)* J4_50(EM_D14)* J4_52(EM_D13)* J4_54(EM_D8)* J4_55(EM_D9)* J4_57(EM_A6)* J4_58(EM_A1)* J4_59(EM_A3)* J4_60(EM_A10)* J4_61(EM_A4)* J4_62(EM_A9)* J4_63(EM_NWP)* J4_64(EM_NCS1)* J4_65(EM_NBE0)* J4_67(EM_NCS6)* J4_68(EM_WAIT0)* J4_69(EM_NBE1)* J4_70(EM_CLK)*

### Notes on the sheet
- All Gumstix Overo boards have the same pin-out, so this should work for all of them
- IMPORTANT: All gumstix I/O has 1.8V logic high.
- Do NOT connect 3.3V I/O directly to gumstix!
- GPIO, can be placed anywhere

### Library data of the parts
C9 = CAP: Capacitor
OMAPRESET = B3FS: SMD tactile switch; Farnell: 3121197; OMRON: B3FS-1052; Digikey: SW792-ND
R8 = RES1: Resistor
U6 = Overo: Gumstix Overo Motherboard

## Nets that join several sheets
1V8: toplevel_os (R70.1), powertrain (C33.1 U12.5), can (5 pins), usb_isolated_uart_x2 (C77.1 U26.1), Gumstix_Overo (R8.2)
5V_REDUNDANT: powertrain (D4.K D5.K TP9.0), sepic (R26.2 TP6.0)
CAN_12V: powertrain (C29.1 C31.1 TP7.0 U11.1), can_transciever_dualvolt_isolated (6 pins)
CANGND: powertrain (6 pins), can_transciever_dualvolt_isolated (11 pins)
VDDA: toplevel_os (R60.1 R64.1), powertrain (5 pins), sepic (R27.1 TP5.0), can (8 pins), LPC1768 (26 pins), can_transciever_dualvolt_isolated (C3.1 U3.8), usb_isolated_uart_x2 (C88.2 U22.5), Gumstix_Overo (U6.J1_66 U6.J1_67 U6.J4_1 U6.J4_2)
VREFN: toplevel_os (5 pins), powertrain (11 pins), supercap (8 pins), sepic (26 pins), can (18 pins), LPC1768 (36 pins), can_transciever_dualvolt_isolated (C3.2 U3.5), usb_isolated_uart_x2 (48 pins), Gumstix_Overo (8 pins)
5V_ISOLATED: powertrain (C30.1 D4.A U11.7), supercap (6 pins)
~{LPCRESET}: can (R6.2), Gumstix_Overo (U6.J1_5)
LEDRED: toplevel_os (R61.1), Gumstix_Overo (U6.J1_16)
LEDYLW: toplevel_os (R71.1), Gumstix_Overo (U6.J1_21)
LPC_CLK: can (U7.16), LPC1768 (U10.62)
LPC_CS: can (U7.15), LPC1768 (U10.63)
LPC_MISO: can (U7.17), LPC1768 (U10.61)
LPC_MOSI: can (U7.18), LPC1768 (U10.60)
LPC_RX: can (U7.14), LPC1768 (U10.74)
LPC_TX: can (U7.13), LPC1768 (U10.75)
NetC35_1: powertrain (C35.1 R22.1 TP12.0), LPC1768 (U10.20)
NetC36_1: powertrain (C36.1 R24.2 R25.2), LPC1768 (U10.21)
NetR4_2: can (R4.2 TP2.0), LPC1768 (U10.14)
NetR39_1: can (R39.1), LPC1768 (U10.32)
NetR43_1: can (R43.1), LPC1768 (U10.34)
NetTP3_0: LPC1768 (U10.66), can_transciever_dualvolt_isolated (TP3.0 U3.7)
NetTP4_0: LPC1768 (U10.65), can_transciever_dualvolt_isolated (TP4.0 U3.6)
NetTP16_0: toplevel_os (TP16.0), Gumstix_Overo (U6.J1_59)
NetTP17_0: toplevel_os (TP17.0), Gumstix_Overo (U6.J1_9)
NetTP19_0: LPC1768 (U10.99), usb_isolated_uart_x2 (TP19.0 U22.4)
NetTP20_0: usb_isolated_uart_x2 (TP20.0 U26.3), Gumstix_Overo (U6.J1_26)
NetTP22_0: usb_isolated_uart_x2 (TP22.0 U26.2), Gumstix_Overo (U6.J1_31)
NetTP28_0: can (TP28.0), LPC1768 (U10.43)
NetTP29_0: toplevel_os (TP29.0), LPC1768 (U10.51)
NetTP30_0: toplevel_os (TP30.0), Gumstix_Overo (U6.J4_41)
NetU6_J4_24: can (U7.7), Gumstix_Overo (U6.J4_24)
NetU6_J4_27: can (U7.6), Gumstix_Overo (U6.J4_27)
NetU6_J4_43: can (U7.5), Gumstix_Overo (U6.J4_43)
NetU6_J4_44: can (U7.3), Gumstix_Overo (U6.J4_44)
NetU6_J4_45: can (U7.4), Gumstix_Overo (U6.J4_45)
NetU6_J4_48: can (U7.8), Gumstix_Overo (U6.J4_48)
~{PFO}: powertrain (R21.1 TP11.0), supercap (U19.8), LPC1768 (U10.57)
PROG: powertrain (R22.2), supercap (R34.1 R35.1 U19.3)
~{RSTOU}T: can (R4.1 R5.2), Gumstix_Overo (U6.J1_3)
SRST: can (7 pins), LPC1768 (J4.15 R11.1 U10.17)
UART1_RXD: LPC1768 (U10.98), usb_isolated_uart_x2 (TP27.0 U25.39)
VBATT: powertrain (J5.1), LPC1768 (U10.19), Gumstix_Overo (U6.J1_52)
VSUPERCAP: powertrain (D5.A R24.1 TP13.0), supercap (C55.1 R32.1 U19.1 U19.2)